# EasyEDA Pro project ProPrj_承载我所有幻想的键盘_2025-02-09.epro, schematic 01-Schematic, sheets 1 to 4 of 8

## Sheets
1 端口: Create Date: 2024-07-30; Page Name: 端口; Project Name: 承载我所有幻想的键盘; Schematic Name: 01-Schematic; Update Date: 2024-07-30
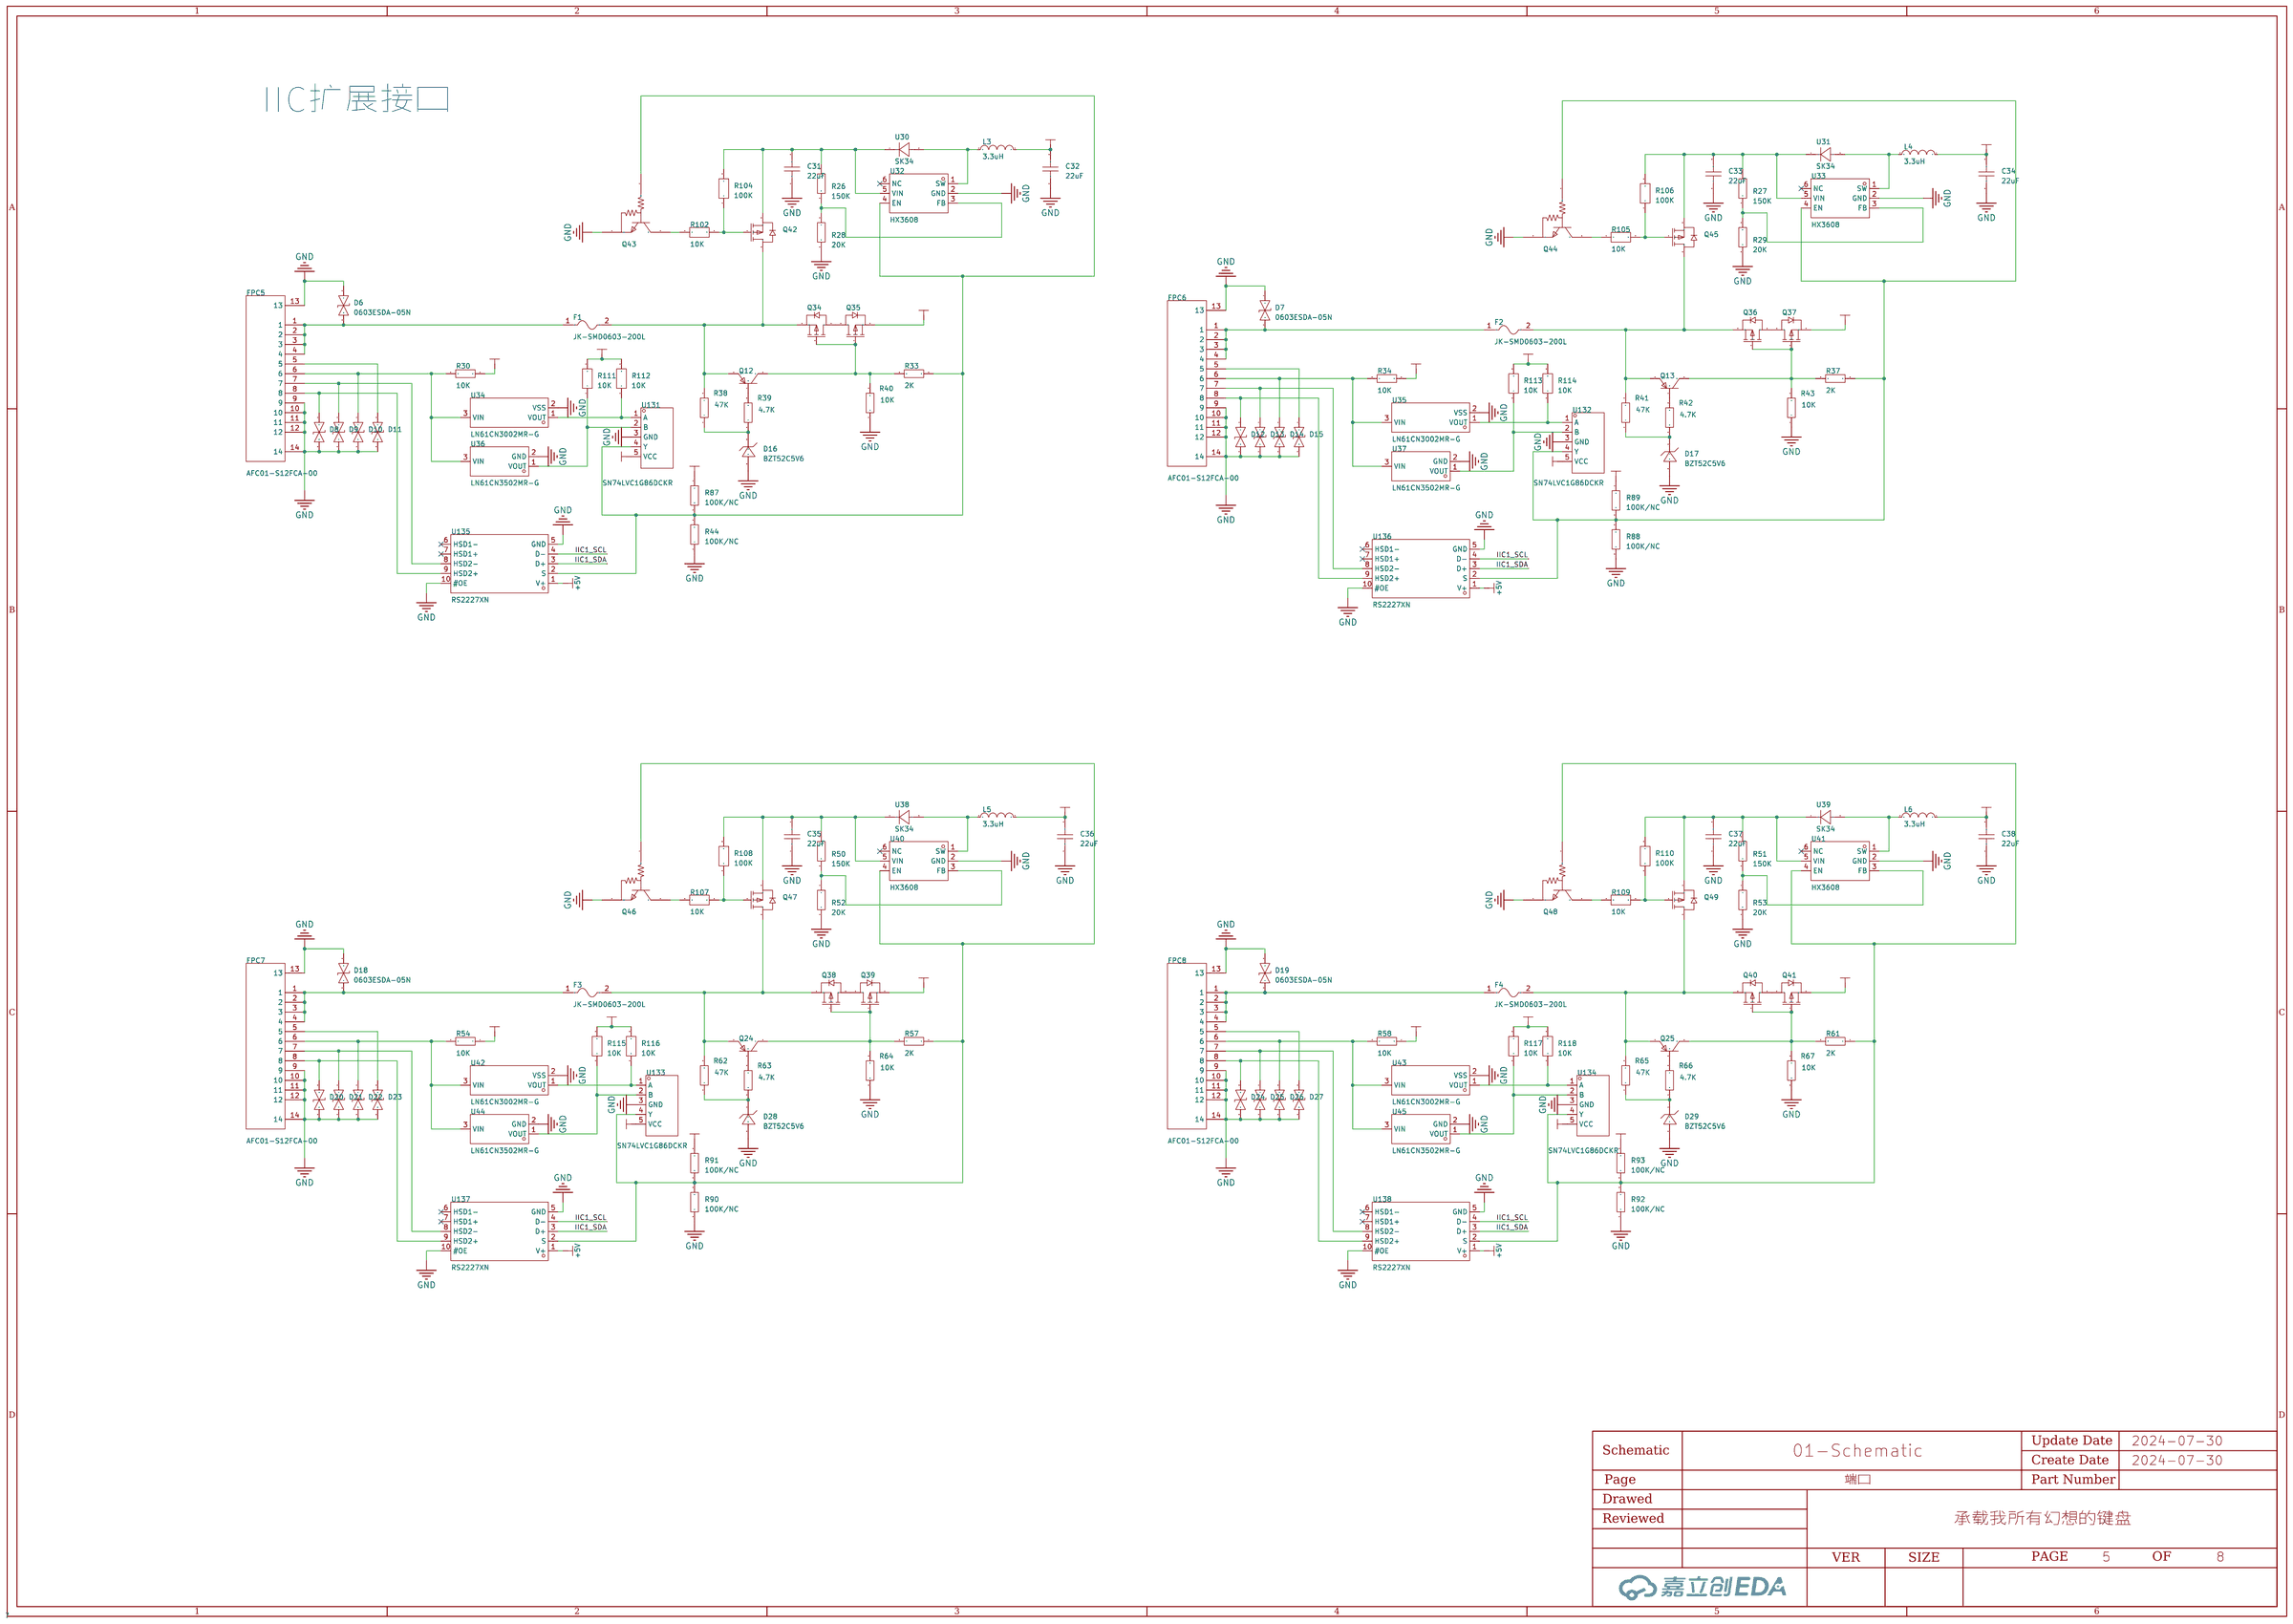
[diagram p0: 端口]
2 按键
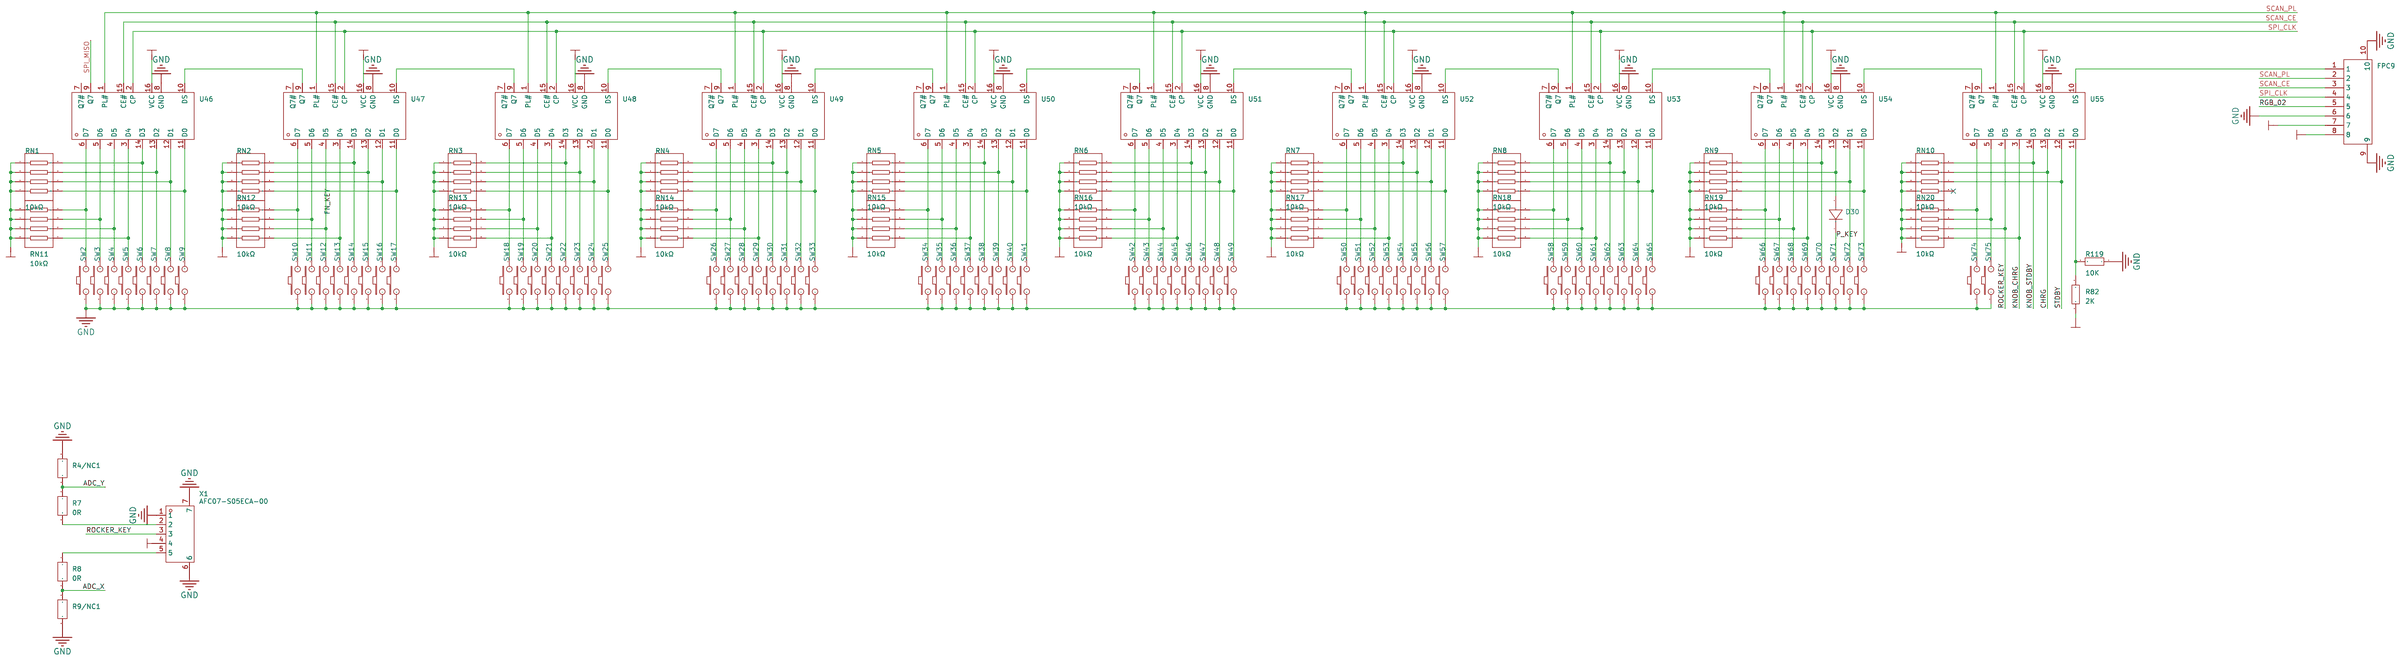
[diagram p1: 按键]
3 灯光
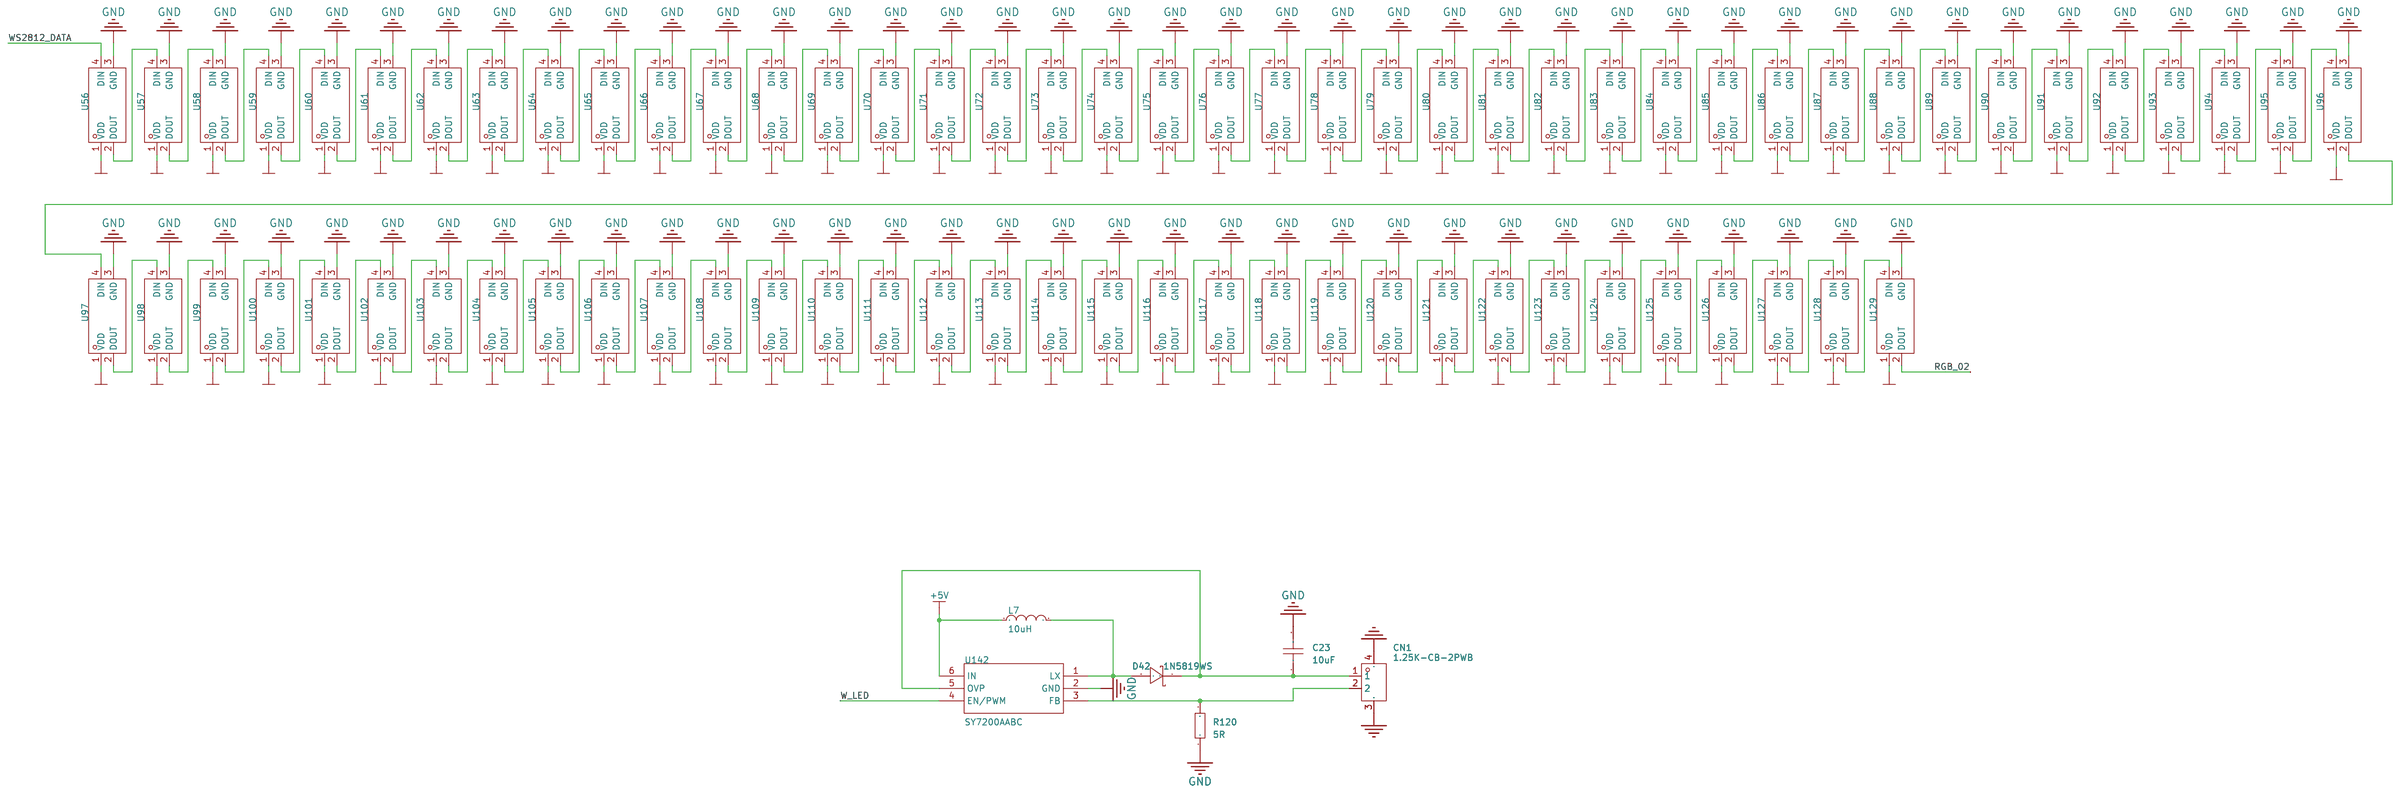
[diagram p2: 灯光]
4 主控: Page Name: 主控
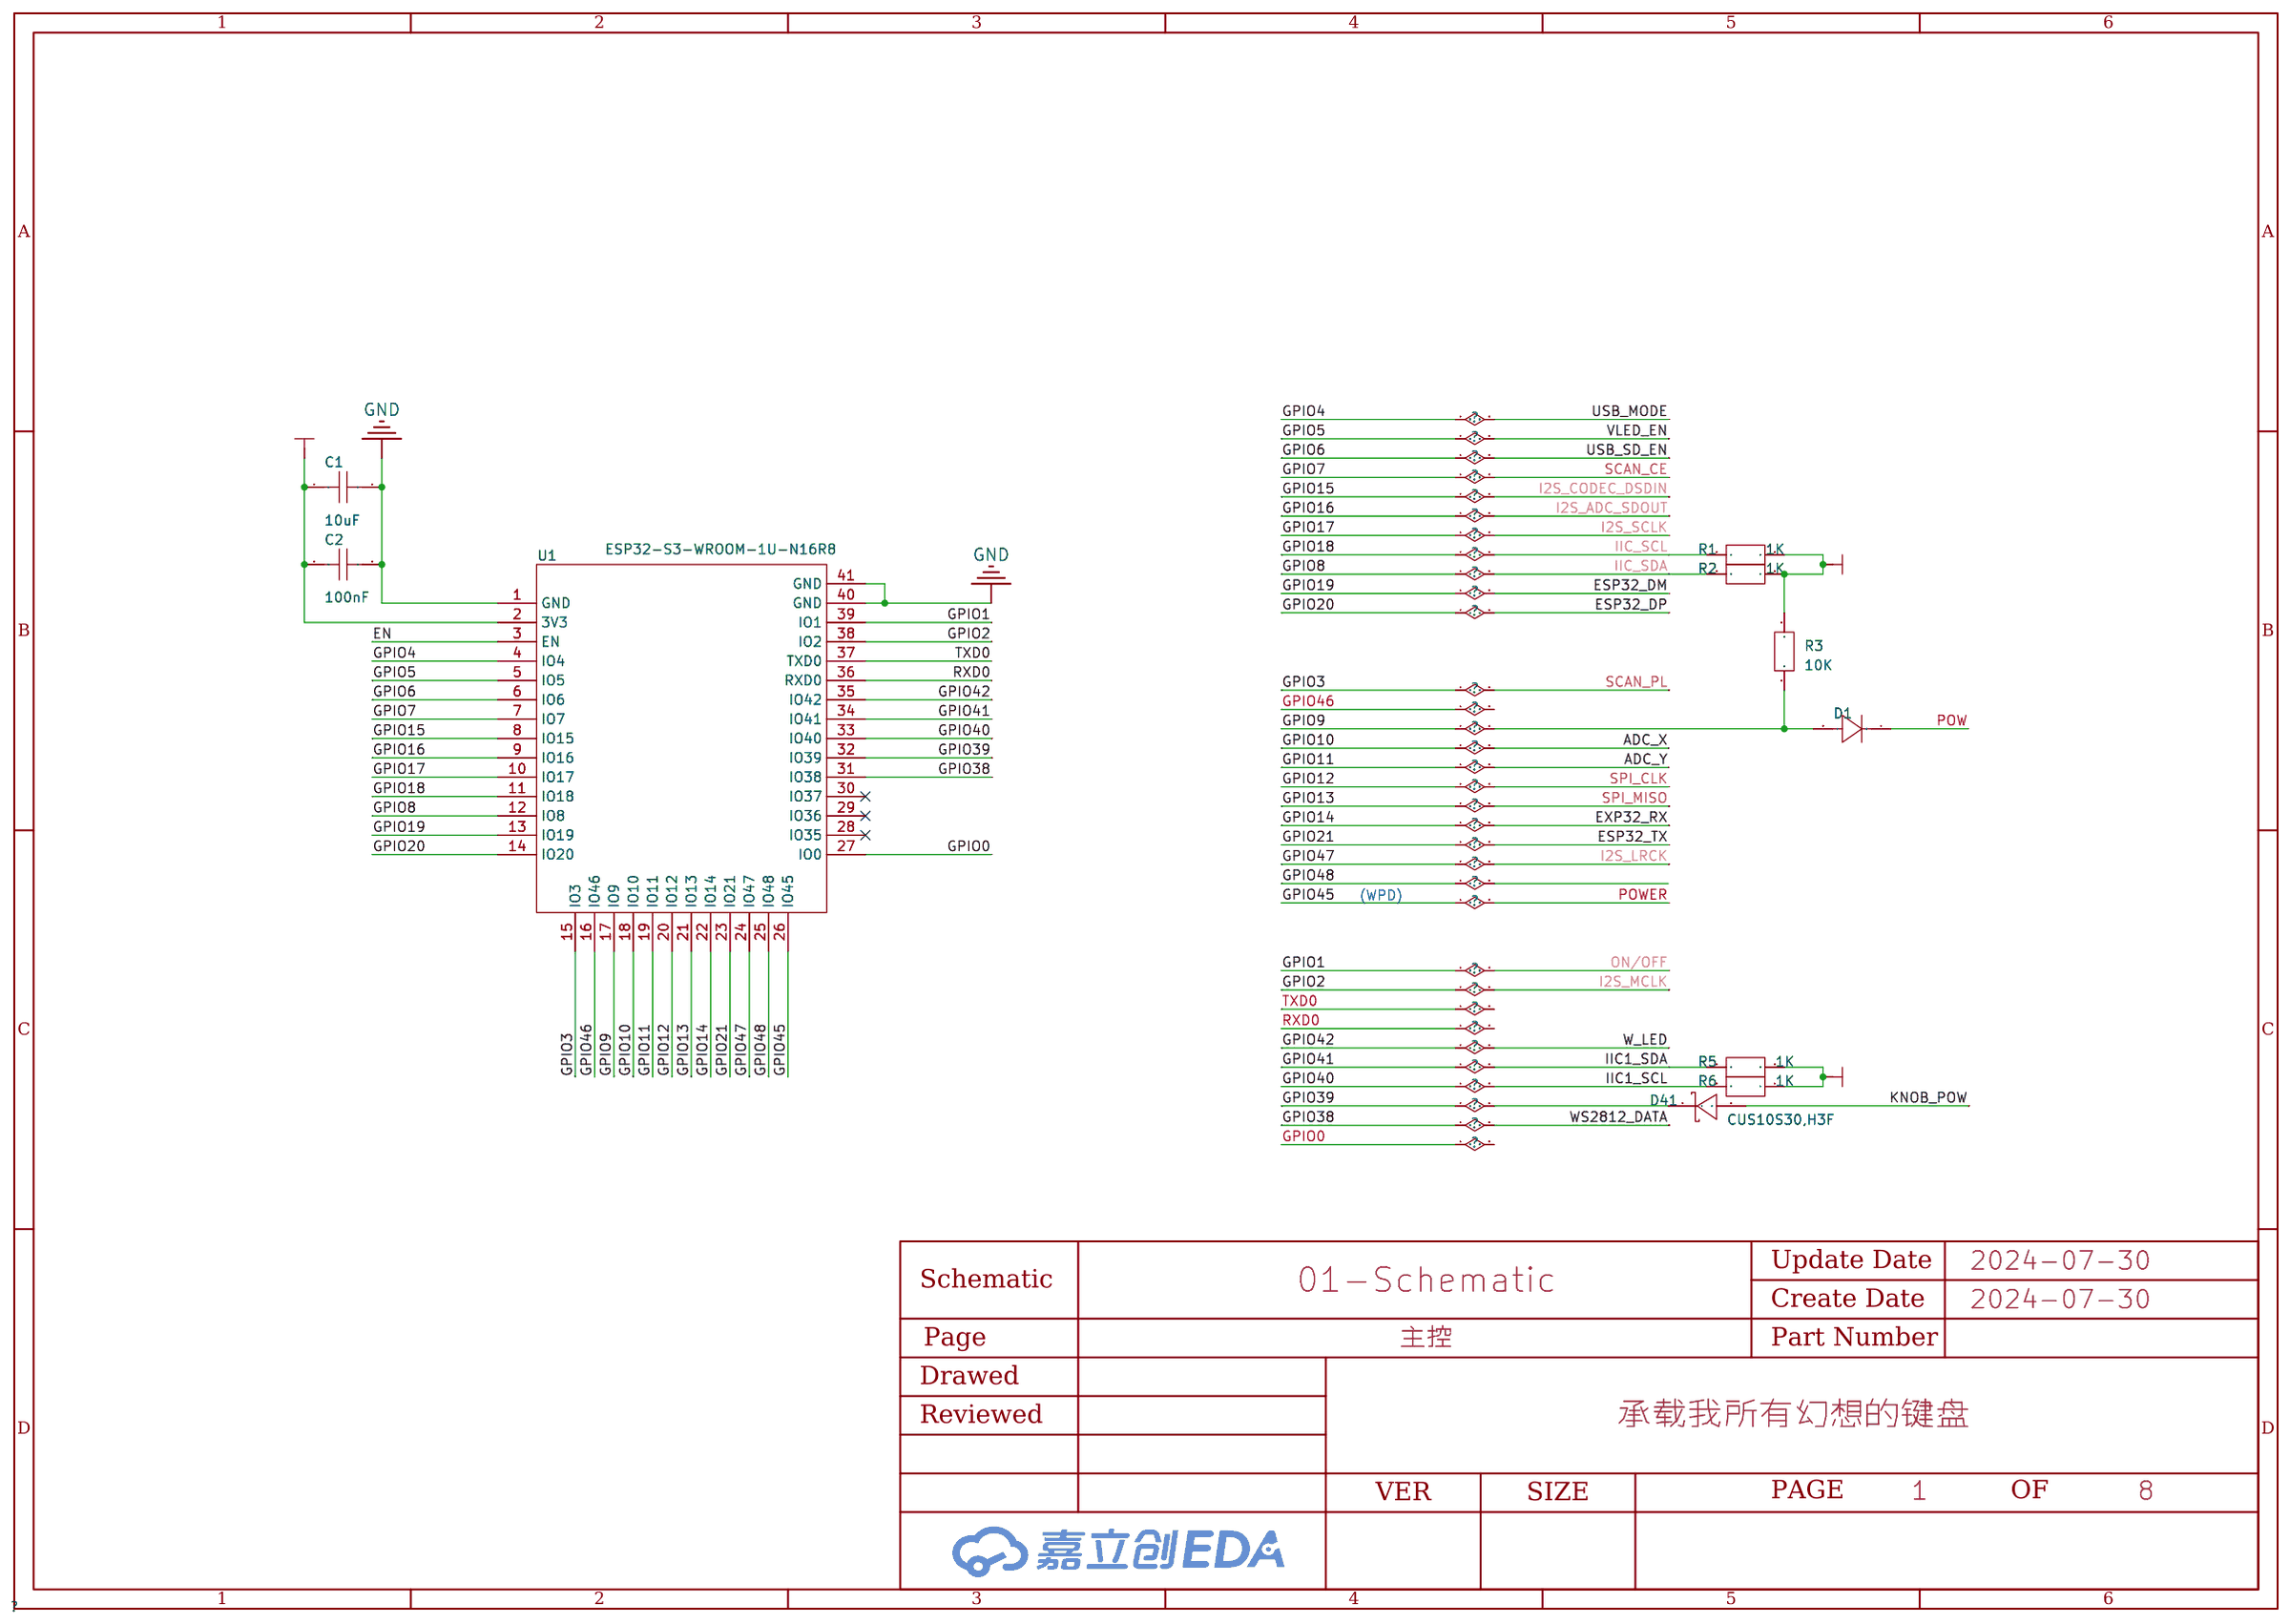
[diagram p3: 主控]

## Parts
sheet 主控
C1  10uF  [C0402]
C2  100nF  [C0402]
D1  1N4148WS  [SOD-323_L1.8-W1.3-LS2.5-RD]
D41  CUS10S30,H3F  [SOD-323_L1.8-W1.3-LS2.5-RD]
R1  1K  [R0402]
R2  1K  [R0402]
R3  10K  [R0402]
R5  1K  [R0402]
R6  1K  [R0402]
U1  ESP32-S3-WROOM-1U-N16R8  [WIRELM-SMD_ESP32-S3-WROOM-1U]
sheet 按键
D30  1N4148WS  [SOD-323_L1.8-W1.3-LS2.5-RD]
FPC9  -  [FPC-SMD_P0.50-8P_FGS-XJ-H2.0]
R4/NC1  SCR0402J10K  [R0402]
R7  0R  [R0402]
R8  0R  [R0402]
R9/NC1  SCR0402J10K  [R0402]
R82  2K  [R0603]
R119  10K  [R0603]
RN1  10kΩ  [RES-ARRAY-SMD_0603-8P-L3.2-W1.6-BL]
RN2  10kΩ  [RES-ARRAY-SMD_0603-8P-L3.2-W1.6-BL]
RN3  10kΩ  [RES-ARRAY-SMD_0603-8P-L3.2-W1.6-BL]
RN4  10kΩ  [RES-ARRAY-SMD_0603-8P-L3.2-W1.6-BL]
RN5  10kΩ  [RES-ARRAY-SMD_0603-8P-L3.2-W1.6-BL]
RN6  10kΩ  [RES-ARRAY-SMD_0603-8P-L3.2-W1.6-BL]
RN7  10kΩ  [RES-ARRAY-SMD_0603-8P-L3.2-W1.6-BL]
RN8  10kΩ  [RES-ARRAY-SMD_0603-8P-L3.2-W1.6-BL]
RN9  10kΩ  [RES-ARRAY-SMD_0603-8P-L3.2-W1.6-BL]
RN10  10kΩ  [RES-ARRAY-SMD_0603-8P-L3.2-W1.6-BL]
RN11  10kΩ  [RES-ARRAY-SMD_0603-8P-L3.2-W1.6-BL]
RN12  10kΩ  [RES-ARRAY-SMD_0603-8P-L3.2-W1.6-BL]
RN13  10kΩ  [RES-ARRAY-SMD_0603-8P-L3.2-W1.6-BL]
RN14  10kΩ  [RES-ARRAY-SMD_0603-8P-L3.2-W1.6-BL]
RN15  10kΩ  [RES-ARRAY-SMD_0603-8P-L3.2-W1.6-BL]
RN16  10kΩ  [RES-ARRAY-SMD_0603-8P-L3.2-W1.6-BL]
RN17  10kΩ  [RES-ARRAY-SMD_0603-8P-L3.2-W1.6-BL]
RN18  10kΩ  [RES-ARRAY-SMD_0603-8P-L3.2-W1.6-BL]
RN19  10kΩ  [RES-ARRAY-SMD_0603-8P-L3.2-W1.6-BL]
RN20  10kΩ  [RES-ARRAY-SMD_0603-8P-L3.2-W1.6-BL]
SW2  -  [轴座_焊接热插拔_不带灯]
SW3  -  [轴座_焊接热插拔_不带灯]
SW4  -  [轴座_焊接热插拔_不带灯]
SW5  -  [轴座_焊接热插拔_不带灯]
SW6  -  [轴座_焊接热插拔_不带灯]
SW7  -  [轴座_焊接热插拔_不带灯]
SW8  -  [轴座_焊接热插拔_不带灯]
SW9  -  [轴座_焊接热插拔_不带灯]
SW10  -  [轴座_焊接热插拔_不带灯]
SW11  -  [轴座_焊接热插拔_不带灯]
SW12  -  [轴座_焊接热插拔_不带灯]
SW13  -  [轴座_焊接热插拔_不带灯]
SW14  -  [轴座_焊接热插拔_不带灯]
SW15  -  [轴座_焊接热插拔_不带灯]
SW16  -  [轴座_焊接热插拔_不带灯]
SW17  -  [轴座_焊接热插拔_不带灯]
SW18  -  [轴座_焊接热插拔_不带灯]
SW19  -  [轴座_焊接热插拔_不带灯]
SW20  -  [轴座_焊接热插拔_不带灯]
SW21  -  [轴座_焊接热插拔_不带灯]
SW22  -  [轴座_焊接热插拔_不带灯]
SW23  -  [轴座_焊接热插拔_不带灯]
SW24  -  [轴座_焊接热插拔_不带灯]
SW25  -  [轴座_焊接热插拔_不带灯]
SW26  -  [轴座_焊接热插拔_不带灯]
SW27  -  [轴座_焊接热插拔_不带灯]
SW28  -  [轴座_焊接热插拔_不带灯]
SW29  -  [轴座_焊接热插拔_不带灯]
SW30  -  [轴座_焊接热插拔_不带灯]
SW31  -  [轴座_焊接热插拔_不带灯]
SW32  -  [轴座_焊接热插拔_不带灯]
SW33  -  [轴座_焊接热插拔_不带灯]
SW34  -  [轴座_焊接热插拔_不带灯]
SW35  -  [轴座_焊接热插拔_不带灯]
SW36  -  [轴座_焊接热插拔_不带灯]
SW37  -  [轴座_焊接热插拔_不带灯]
SW38  -  [轴座_焊接热插拔_不带灯]
SW39  -  [轴座_焊接热插拔_不带灯]
SW40  -  [轴座_焊接热插拔_不带灯]
SW41  -  [轴座_焊接热插拔_不带灯]
SW42  -  [轴座_焊接热插拔_不带灯]
SW43  -  [轴座_焊接热插拔_不带灯]
SW44  -  [轴座_焊接热插拔_不带灯]
SW45  -  [轴座_焊接热插拔_不带灯]
SW46  -  [轴座_焊接热插拔_不带灯]
SW47  -  [轴座_焊接热插拔_不带灯]
SW48  -  [轴座_焊接热插拔_不带灯]
SW49  -  [轴座_焊接热插拔_不带灯]
SW50  -  [轴座_焊接热插拔_不带灯]
SW51  -  [轴座_焊接热插拔_不带灯]
SW52  -  [轴座_焊接热插拔_不带灯]
SW53  -  [轴座_焊接热插拔_不带灯]
SW54  -  [轴座_焊接热插拔_不带灯]
SW55  -  [轴座_焊接热插拔_不带灯]
SW56  -  [轴座_焊接热插拔_不带灯]
SW57  -  [轴座_焊接热插拔_不带灯]
SW58  -  [轴座_焊接热插拔_不带灯]
SW59  -  [轴座_焊接热插拔_不带灯]
SW60  -  [轴座_焊接热插拔_不带灯]
SW61  -  [轴座_焊接热插拔_不带灯]
SW62  -  [轴座_焊接热插拔_不带灯]
SW63  -  [轴座_焊接热插拔_不带灯]
SW64  -  [轴座_焊接热插拔_不带灯]
SW65  -  [轴座_焊接热插拔_不带灯]
SW66  -  [轴座_焊接热插拔_不带灯]
SW67  -  [轴座_焊接热插拔_不带灯]
SW68  -  [轴座_焊接热插拔_不带灯]
SW69  -  [轴座_焊接热插拔_不带灯]
SW70  -  [轴座_焊接热插拔_不带灯]
SW71  -  [轴座_焊接热插拔_不带灯]
SW72  -  [轴座_焊接热插拔_不带灯]
SW73  -  [轴座_焊接热插拔_不带灯]
SW74  -  [轴座_焊接热插拔_不带灯]
SW75  -  [轴座_焊接热插拔_不带灯]
U46  -  [SOIC-16_L9.9-W3.9-P1.27-LS6.0-BL]
U47  -  [SOIC-16_L9.9-W3.9-P1.27-LS6.0-BL]
U48  -  [SOIC-16_L9.9-W3.9-P1.27-LS6.0-BL]
U49  -  [SOIC-16_L9.9-W3.9-P1.27-LS6.0-BL]
U50  -  [SOIC-16_L9.9-W3.9-P1.27-LS6.0-BL]
U51  -  [SOIC-16_L9.9-W3.9-P1.27-LS6.0-BL]
U52  -  [SOIC-16_L9.9-W3.9-P1.27-LS6.0-BL]
U53  -  [SOIC-16_L9.9-W3.9-P1.27-LS6.0-BL]
U54  -  [SOIC-16_L9.9-W3.9-P1.27-LS6.0-BL]
U55  -  [SOIC-16_L9.9-W3.9-P1.27-LS6.0-BL]
X1  AFC07-S05ECA-00  [FPC-SMD_AFC07-S05ECA-00]
sheet 灯光
C23  10uF  [C0402]
CN1  1.25K-CB-2PWB  [CONN-SMD_2P-P1.25_L5.5-W7.7-2PWB]
D42  1N5819WS  [SOD-323_L1.8-W1.3-LS2.5-RD]
L7  10uH  [IND-SMD_L2.5-W2.0]
R120  5R  [R0402]
U56  Yo-WS2812B-3528反贴雾状  [LED-SMD_L3.2-W2.8-BR_DY-S352818]
U57  Yo-WS2812B-3528反贴雾状  [LED-SMD_L3.2-W2.8-BR_DY-S352818]
U58  Yo-WS2812B-3528反贴雾状  [LED-SMD_L3.2-W2.8-BR_DY-S352818]
U59  Yo-WS2812B-3528反贴雾状  [LED-SMD_L3.2-W2.8-BR_DY-S352818]
U60  Yo-WS2812B-3528反贴雾状  [LED-SMD_L3.2-W2.8-BR_DY-S352818]
U61  Yo-WS2812B-3528反贴雾状  [LED-SMD_L3.2-W2.8-BR_DY-S352818]
U62  Yo-WS2812B-3528反贴雾状  [LED-SMD_L3.2-W2.8-BR_DY-S352818]
U63  Yo-WS2812B-3528反贴雾状  [LED-SMD_L3.2-W2.8-BR_DY-S352818]
U64  Yo-WS2812B-3528反贴雾状  [LED-SMD_L3.2-W2.8-BR_DY-S352818]
U65  Yo-WS2812B-3528反贴雾状  [LED-SMD_L3.2-W2.8-BR_DY-S352818]
U66  Yo-WS2812B-3528反贴雾状  [LED-SMD_L3.2-W2.8-BR_DY-S352818]
U67  Yo-WS2812B-3528反贴雾状  [LED-SMD_L3.2-W2.8-BR_DY-S352818]
U68  Yo-WS2812B-3528反贴雾状  [LED-SMD_L3.2-W2.8-BR_DY-S352818]
U69  Yo-WS2812B-3528反贴雾状  [LED-SMD_L3.2-W2.8-BR_DY-S352818]
U70  Yo-WS2812B-3528反贴雾状  [LED-SMD_L3.2-W2.8-BR_DY-S352818]
U71  Yo-WS2812B-3528反贴雾状  [LED-SMD_L3.2-W2.8-BR_DY-S352818]
U72  Yo-WS2812B-3528反贴雾状  [LED-SMD_L3.2-W2.8-BR_DY-S352818]
U73  Yo-WS2812B-3528反贴雾状  [LED-SMD_L3.2-W2.8-BR_DY-S352818]
U74  Yo-WS2812B-3528反贴雾状  [LED-SMD_L3.2-W2.8-BR_DY-S352818]
U75  Yo-WS2812B-3528反贴雾状  [LED-SMD_L3.2-W2.8-BR_DY-S352818]
U76  Yo-WS2812B-3528反贴雾状  [LED-SMD_L3.2-W2.8-BR_DY-S352818]
U77  Yo-WS2812B-3528反贴雾状  [LED-SMD_L3.2-W2.8-BR_DY-S352818]
U78  Yo-WS2812B-3528反贴雾状  [LED-SMD_L3.2-W2.8-BR_DY-S352818]
U79  Yo-WS2812B-3528反贴雾状  [LED-SMD_L3.2-W2.8-BR_DY-S352818]
U80  Yo-WS2812B-3528反贴雾状  [LED-SMD_L3.2-W2.8-BR_DY-S352818]
U81  Yo-WS2812B-3528反贴雾状  [LED-SMD_L3.2-W2.8-BR_DY-S352818]
U82  Yo-WS2812B-3528反贴雾状  [LED-SMD_L3.2-W2.8-BR_DY-S352818]
U83  Yo-WS2812B-3528反贴雾状  [LED-SMD_L3.2-W2.8-BR_DY-S352818]
U84  Yo-WS2812B-3528反贴雾状  [LED-SMD_L3.2-W2.8-BR_DY-S352818]
U85  Yo-WS2812B-3528反贴雾状  [LED-SMD_L3.2-W2.8-BR_DY-S352818]
U86  Yo-WS2812B-3528反贴雾状  [LED-SMD_L3.2-W2.8-BR_DY-S352818]
U87  Yo-WS2812B-3528反贴雾状  [LED-SMD_L3.2-W2.8-BR_DY-S352818]
U88  Yo-WS2812B-3528反贴雾状  [LED-SMD_L3.2-W2.8-BR_DY-S352818]
U89  Yo-WS2812B-3528反贴雾状  [LED-SMD_L3.2-W2.8-BR_DY-S352818]
U90  Yo-WS2812B-3528反贴雾状  [LED-SMD_L3.2-W2.8-BR_DY-S352818]
U91  Yo-WS2812B-3528反贴雾状  [LED-SMD_L3.2-W2.8-BR_DY-S352818]
U92  Yo-WS2812B-3528反贴雾状  [LED-SMD_L3.2-W2.8-BR_DY-S352818]
U93  Yo-WS2812B-3528反贴雾状  [LED-SMD_L3.2-W2.8-BR_DY-S352818]
U94  Yo-WS2812B-3528反贴雾状  [LED-SMD_L3.2-W2.8-BR_DY-S352818]
U95  Yo-WS2812B-3528反贴雾状  [LED-SMD_L3.2-W2.8-BR_DY-S352818]
U96  Yo-WS2812B-3528反贴雾状  [LED-SMD_L3.2-W2.8-BR_DY-S352818]
U97  Yo-WS2812B-3528反贴雾状  [LED-SMD_L3.2-W2.8-BR_DY-S352818]
U98  Yo-WS2812B-3528反贴雾状  [LED-SMD_L3.2-W2.8-BR_DY-S352818]
U99  Yo-WS2812B-3528反贴雾状  [LED-SMD_L3.2-W2.8-BR_DY-S352818]
U100  Yo-WS2812B-3528反贴雾状  [LED-SMD_L3.2-W2.8-BR_DY-S352818]
U101  Yo-WS2812B-3528反贴雾状  [LED-SMD_L3.2-W2.8-BR_DY-S352818]
U102  Yo-WS2812B-3528反贴雾状  [LED-SMD_L3.2-W2.8-BR_DY-S352818]
U103  Yo-WS2812B-3528反贴雾状  [LED-SMD_L3.2-W2.8-BR_DY-S352818]
U104  Yo-WS2812B-3528反贴雾状  [LED-SMD_L3.2-W2.8-BR_DY-S352818]
U105  Yo-WS2812B-3528反贴雾状  [LED-SMD_L3.2-W2.8-BR_DY-S352818]
U106  Yo-WS2812B-3528反贴雾状  [LED-SMD_L3.2-W2.8-BR_DY-S352818]
U107  Yo-WS2812B-3528反贴雾状  [LED-SMD_L3.2-W2.8-BR_DY-S352818]
U108  Yo-WS2812B-3528反贴雾状  [LED-SMD_L3.2-W2.8-BR_DY-S352818]
U109  Yo-WS2812B-3528反贴雾状  [LED-SMD_L3.2-W2.8-BR_DY-S352818]
U110  Yo-WS2812B-3528反贴雾状  [LED-SMD_L3.2-W2.8-BR_DY-S352818]
U111  Yo-WS2812B-3528反贴雾状  [LED-SMD_L3.2-W2.8-BR_DY-S352818]
U112  Yo-WS2812B-3528反贴雾状  [LED-SMD_L3.2-W2.8-BR_DY-S352818]
U113  Yo-WS2812B-3528反贴雾状  [LED-SMD_L3.2-W2.8-BR_DY-S352818]
U114  Yo-WS2812B-3528反贴雾状  [LED-SMD_L3.2-W2.8-BR_DY-S352818]
U115  Yo-WS2812B-3528反贴雾状  [LED-SMD_L3.2-W2.8-BR_DY-S352818]
U116  Yo-WS2812B-3528反贴雾状  [LED-SMD_L3.2-W2.8-BR_DY-S352818]
U117  Yo-WS2812B-3528反贴雾状  [LED-SMD_L3.2-W2.8-BR_DY-S352818]
U118  Yo-WS2812B-3528反贴雾状  [LED-SMD_L3.2-W2.8-BR_DY-S352818]
U119  Yo-WS2812B-3528反贴雾状  [LED-SMD_L3.2-W2.8-BR_DY-S352818]
U120  Yo-WS2812B-3528反贴雾状  [LED-SMD_L3.2-W2.8-BR_DY-S352818]
U121  Yo-WS2812B-3528反贴雾状  [LED-SMD_L3.2-W2.8-BR_DY-S352818]
U122  Yo-WS2812B-3528反贴雾状  [LED-SMD_L3.2-W2.8-BR_DY-S352818]
U123  Yo-WS2812B-3528反贴雾状  [LED-SMD_L3.2-W2.8-BR_DY-S352818]
U124  Yo-WS2812B-3528反贴雾状  [LED-SMD_L3.2-W2.8-BR_DY-S352818]
U125  Yo-WS2812B-3528反贴雾状  [LED-SMD_L3.2-W2.8-BR_DY-S352818]
U126  Yo-WS2812B-3528反贴雾状  [LED-SMD_L3.2-W2.8-BR_DY-S352818]
U127  Yo-WS2812B-3528反贴雾状  [LED-SMD_L3.2-W2.8-BR_DY-S352818]
U128  Yo-WS2812B-3528反贴雾状  [LED-SMD_L3.2-W2.8-BR_DY-S352818]
U129  Yo-WS2812B-3528反贴雾状  [LED-SMD_L3.2-W2.8-BR_DY-S352818]
U142  SY7200AABC  [SOT-23-6_L2.9-W1.6-P0.95-LS2.8-BR]
sheet 端口
C31  22uF  [C0603]
C32  22uF  [C0603]
C33  22uF  [C0603]
C34  22uF  [C0603]
C35  22uF  [C0603]
C36  22uF  [C0603]
C37  22uF  [C0603]
C38  22uF  [C0603]
D6  0603ESDA-05N  [D0603-BI]
D7  0603ESDA-05N  [D0603-BI]
D8  0603ESDA-05N  [D0603-BI]
D9  0603ESDA-05N  [D0603-BI]
D10  0603ESDA-05N  [D0603-BI]
D11  0603ESDA-05N  [D0603-BI]
D12  0603ESDA-05N  [D0603-BI]
D13  0603ESDA-05N  [D0603-BI]
D14  0603ESDA-05N  [D0603-BI]
D15  0603ESDA-05N  [D0603-BI]
D16  BZT52C5V6  [SOD-123_L2.8-W1.8-LS3.7-RD]
D17  BZT52C5V6  [SOD-123_L2.8-W1.8-LS3.7-RD]
D18  0603ESDA-05N  [D0603-BI]
D19  0603ESDA-05N  [D0603-BI]
D20  0603ESDA-05N  [D0603-BI]
D21  0603ESDA-05N  [D0603-BI]
D22  0603ESDA-05N  [D0603-BI]
D23  0603ESDA-05N  [D0603-BI]
D24  0603ESDA-05N  [D0603-BI]
D25  0603ESDA-05N  [D0603-BI]
D26  0603ESDA-05N  [D0603-BI]
D27  0603ESDA-05N  [D0603-BI]
D28  BZT52C5V6  [SOD-123_L2.8-W1.8-LS3.7-RD]
D29  BZT52C5V6  [SOD-123_L2.8-W1.8-LS3.7-RD]
F1  JK-SMD0603-200L  [F0603]
F2  JK-SMD0603-200L  [F0603]
F3  JK-SMD0603-200L  [F0603]
F4  JK-SMD0603-200L  [F0603]
FPC5  AFC01-S12FCA-00  [FPC-SMD_AFC01-S12FCA-00]
FPC6  AFC01-S12FCA-00  [FPC-SMD_AFC01-S12FCA-00]
FPC7  AFC01-S12FCA-00  [FPC-SMD_AFC01-S12FCA-00]
FPC8  AFC01-S12FCA-00  [FPC-SMD_AFC01-S12FCA-00]
L3  3.3uH  [IND-SMD_L4.4-W4.2-A]
L4  3.3uH  [IND-SMD_L4.4-W4.2-A]
L5  3.3uH  [IND-SMD_L4.4-W4.2-A]
L6  3.3uH  [IND-SMD_L4.4-W4.2-A]
Q12  -  [TO-236-3_L2.9-W1.3-P1.90-LS2.4-BR]
Q13  -  [TO-236-3_L2.9-W1.3-P1.90-LS2.4-BR]
Q24  -  [TO-236-3_L2.9-W1.3-P1.90-LS2.4-BR]
Q25  -  [TO-236-3_L2.9-W1.3-P1.90-LS2.4-BR]
Q34  3401  [SOT-23-3_L2.9-W1.3-P1.90-LS2.4-BR]
Q35  3401  [SOT-23-3_L2.9-W1.3-P1.90-LS2.4-BR]
Q36  3401  [SOT-23-3_L2.9-W1.3-P1.90-LS2.4-BR]
Q37  3401  [SOT-23-3_L2.9-W1.3-P1.90-LS2.4-BR]
Q38  3401  [SOT-23-3_L2.9-W1.3-P1.90-LS2.4-BR]
Q39  3401  [SOT-23-3_L2.9-W1.3-P1.90-LS2.4-BR]
Q40  3401  [SOT-23-3_L2.9-W1.3-P1.90-LS2.4-BR]
Q41  3401  [SOT-23-3_L2.9-W1.3-P1.90-LS2.4-BR]
Q42  3401  [SOT-23-3_L2.9-W1.3-P1.90-LS2.4-BR]
Q43  LMUN2212LT1G  [SOT-23-3_L2.9-W1.3-P1.90-LS2.4-BR]
Q44  LMUN2212LT1G  [SOT-23-3_L2.9-W1.3-P1.90-LS2.4-BR]
Q45  3401  [SOT-23-3_L2.9-W1.3-P1.90-LS2.4-BR]
Q46  LMUN2212LT1G  [SOT-23-3_L2.9-W1.3-P1.90-LS2.4-BR]
Q47  3401  [SOT-23-3_L2.9-W1.3-P1.90-LS2.4-BR]
Q48  LMUN2212LT1G  [SOT-23-3_L2.9-W1.3-P1.90-LS2.4-BR]
Q49  3401  [SOT-23-3_L2.9-W1.3-P1.90-LS2.4-BR]
R26  150K  [R0603]
R27  150K  [R0603]
R28  20K  [R0603]
R29  20K  [R0603]
R30  10K  [R0603]
R33  2K  [R0603]
R34  10K  [R0603]
R37  2K  [R0603]
R38  47K  [R0603]
R39  4.7K  [R0603]
R40  10K  [R0603]
R41  47K  [R0603]
R42  4.7K  [R0603]
R43  10K  [R0603]
R44  100K/NC  [R0603]
R50  150K  [R0603]
R51  150K  [R0603]
R52  20K  [R0603]
R53  20K  [R0603]
R54  10K  [R0603]
R57  2K  [R0603]
R58  10K  [R0603]
R61  2K  [R0603]
R62  47K  [R0603]
R63  4.7K  [R0603]
R64  10K  [R0603]
R65  47K  [R0603]
R66  4.7K  [R0603]
R67  10K  [R0603]
R87  100K/NC  [R0603]
R88  100K/NC  [R0603]
R89  100K/NC  [R0603]
R90  100K/NC  [R0603]
R91  100K/NC  [R0603]
R92  100K/NC  [R0603]
R93  100K/NC  [R0603]
R102  10K  [R0603]
R104  100K  [R0603]
R105  10K  [R0603]
R106  100K  [R0603]
R107  10K  [R0603]
R108  100K  [R0603]
R109  10K  [R0603]
R110  100K  [R0603]
R111  10K  [R0603]
R112  10K  [R0603]
R113  10K  [R0603]
R114  10K  [R0603]
R115  10K  [R0603]
R116  10K  [R0603]
R117  10K  [R0603]
R118  10K  [R0603]
U30  SK34  [SMA_L4.3-W2.6-LS5.1-RD]
U31  SK34  [SMA_L4.3-W2.6-LS5.1-RD]
U32  HX3608  [SOT-23-6_L2.9-W1.6-P0.95-LS2.8-BR]
U33  HX3608  [SOT-23-6_L2.9-W1.6-P0.95-LS2.8-BR]
U34  LN61CN3002MR-G  [SOT-23-3_L2.9-W1.6-P1.90-LS2.8-BR]
U35  LN61CN3002MR-G  [SOT-23-3_L2.9-W1.6-P1.90-LS2.8-BR]
U36  LN61CN3502MR-G  [SOT-23_L2.9-W1.3-P1.90-LS2.4-BR]
U37  LN61CN3502MR-G  [SOT-23_L2.9-W1.3-P1.90-LS2.4-BR]
U38  SK34  [SMA_L4.3-W2.6-LS5.1-RD]
U39  SK34  [SMA_L4.3-W2.6-LS5.1-RD]
U40  HX3608  [SOT-23-6_L2.9-W1.6-P0.95-LS2.8-BR]
U41  HX3608  [SOT-23-6_L2.9-W1.6-P0.95-LS2.8-BR]
U42  LN61CN3002MR-G  [SOT-23-3_L2.9-W1.6-P1.90-LS2.8-BR]
U43  LN61CN3002MR-G  [SOT-23-3_L2.9-W1.6-P1.90-LS2.8-BR]
U44  LN61CN3502MR-G  [SOT-23_L2.9-W1.3-P1.90-LS2.4-BR]
U45  LN61CN3502MR-G  [SOT-23_L2.9-W1.3-P1.90-LS2.4-BR]
U131  SN74LVC1G86DCKR  [SC-70-5_L2.1-W1.3-P0.65-LS2.1-BR]
U132  SN74LVC1G86DCKR  [SC-70-5_L2.1-W1.3-P0.65-LS2.1-BR]
U133  SN74LVC1G86DCKR  [SC-70-5_L2.1-W1.3-P0.65-LS2.1-BR]
U134  SN74LVC1G86DCKR  [SC-70-5_L2.1-W1.3-P0.65-LS2.1-BR]
U135  RS2227XN  [MSOP-10_L3.0-W3.0-P0.50-LS5.0-BL]
U136  RS2227XN  [MSOP-10_L3.0-W3.0-P0.50-LS5.0-BL]
U137  RS2227XN  [MSOP-10_L3.0-W3.0-P0.50-LS5.0-BL]
U138  RS2227XN  [MSOP-10_L3.0-W3.0-P0.50-LS5.0-BL]

## Library data of the parts
C1 = ZRB15XR61A106ME01D: 容值:10uF;精度:±20%;额定电压:-;材质(温度系数):-;; LCSC Part Name: 10uF ±20%; Supplier Part: C527590; Manufacturer: muRata(村田); Supplier Footprint: 0402; JLCPCB Part Class: 扩展库; Datasheet: https://atta.szlcsc.com/upload/public/pdf/source/20200507/C527590_05B2D18D24F6232E70970638CDBF66E1.pdf; Supplier: LCSC; Tolerance: ±20%
C2 = GCM155R71C104KA55J: 容值:100nF;精度:±10%;额定电压:-;材质(温度系数):-;; LCSC Part Name: 100nF ±10%; Supplier Part: C2655418; Manufacturer: muRata(村田); Supplier Footprint: 0402; JLCPCB Part Class: 扩展库; Datasheet: https://atta.szlcsc.com/upload/public/pdf/source/20210701/42090801FDE37D0E45AFF657247F4A08.pdf; Supplier: LCSC; Tolerance: ±10%
D1 D30 = 1N4148WS_C727111: 二极管配置:独立式;功率:400mW;直流反向耐压(Vr):100V;平均整流电流(Io):300mA;正向压降(Vf):1.25V@150mA;反向电流(Ir):1A@75V;反向恢复时间(trr):8ns;工作温度:-55~+150@(Tj);; LCSC Part Name: 100V 300mA 8ns; Supplier Part: C727111; Manufacturer: TWGMC(台湾迪嘉); Supplier Footprint: SOD-323; JLCPCB Part Class: Extended Part; Datasheet: https://atta.szlcsc.com/upload/public/pdf/source/20200828/C727111_E7108F014A9288D320E3440593CCDF54.pdf; Supplier: LCSC; Diode Configuration: 独立式; Power Dissipation: 400mW; Reverse Voltage (Vr): 100V; Average Rectified Current (Io): 300mA; Forward Voltage (Vf@If): 1.25V@150mA; Reverse Leakage Current: 1A@75V; Reverse Recovery Time (trr): 8ns; Operating Temperature: -55~+150@(Tj)
D41 = CUS10S30,H3F: 正向压降(Vf):230mV@100mA;直流反向耐压(Vr):30V;平均整流电流(Io):1A;; LCSC Part Name: 电压:30V 电流:1A; Supplier Part: C146335; Manufacturer: TOSHIBA(东芝); Supplier Footprint: SC-76(SOD-323); Datasheet: https://atta.szlcsc.com/upload/public/pdf/source/20171211/C146335_15129763734771175369.pdf; Supplier: LCSC; Forward Voltage (Vf@If): 230mV@100mA; Reverse Voltage (Vr): 30V; Average Rectified Current (Io): 1A; Reverse Leakage Current (Ir): 500uA@30V
R1-R3 R4/NC1 R5-R8 R9/NC1 = SCR0402J10K: Supplier Part: C3017497; Manufacturer: VO(翔胜); Supplier Footprint: 0402; JLCPCB Part Class: 扩展库; Datasheet: https://atta.szlcsc.com/upload/public/pdf/source/20220513/247AF9639BA21CF93567DC289CCC6A22.pdf; Supplier: LCSC
U1 = ESP32-S3-WROOM-1U-N16R8: Supplier Part: C3013946; Manufacturer: ESPRESSIF(乐鑫); Supplier Footprint: SMD; JLCPCB Part Class: 扩展库; Datasheet: https://atta.szlcsc.comnull; Supplier: LCSC
FPC9 = AFC01-S08FCA-00: 间距:0.5mm;触点数量:8;锁定特性:翻盖式;安装类型:卧贴;触点类型:下接;; LCSC Part Name: 0.5mm P数:8 翻盖式 下接; Supplier Part: C262657; Manufacturer: JS(钜硕电子); Supplier Footprint: SMD,P=0.5mm; Datasheet: https://atta.szlcsc.com/upload/public/pdf/source/20180814/C262657_E4DDBFDEF95394073062C4B6399AAD54.pdf; Supplier: LCSC; Pitch: 0.5mm; Number of Contacts: 8; Locking Feature: 翻盖式; Mounting Type: 卧贴; Contact Type: 下接; Height Above Board: 2mm; FFC, FCB Thickness: 0.3mm
R26-R30 R33 R34 R37-R44 R50-R54 R57 R58 R61-R67 R82 R87-R93 R119 = Res_0603: Supplier Footprint: 0603
RN1-RN10 RN12-RN20 = 4D03WGJ0103T5E: 阻值:10kΩ;精度:±5%;单个元件功率:62.5mW;温度系数:±200ppm/;电阻器数:4;引脚数:8;; LCSC Part Name: 10kΩ ±5%; Supplier Part: C29718; Manufacturer: UNI-ROYAL(厚声); Supplier Footprint: 0603x4; Datasheet: https://atta.szlcsc.com/upload/public/pdf/source/20170615/1497511005633.pdf; Supplier: LCSC; Tolerance: ±5%; Power(Watts): 62.5mW; Temperature Coefficient: ±200ppm/; Number of Resistors: 4; Number of Pins: 8
RN11 = 4D03WGJ0103T5E: 阻值:10kΩ;精度:±5%;单个元件功率:62.5mW;温度系数:±200ppm/℃;电阻器数:4;引脚数:8;; LCSC Part Name: 10kΩ ±5%; Supplier Part: C29718; Manufacturer: UNI-ROYAL(厚声); Supplier Footprint: 0603x4; Datasheet: https://atta.szlcsc.com/upload/public/pdf/source/20170615/1497511005633.pdf; Supplier: LCSC; Tolerance: ±5%; Power(Watts): 62.5mW; Temperature Coefficient: ±200ppm/℃; Number of Resistors: 4; Number of Pins: 8
SW2-SW75 = KEYBOARD-SW: Origin Footprint 2: MX-KEY
U46-U55 = 74HC165D,653: Supplier Part: C5613; Manufacturer: Nexperia(安世); Supplier Footprint: SOIC-16_150mil; Datasheet: https://atta.szlcsc.com/upload/public/pdf/source/20160218/1457707760975.pdf; Supplier: LCSC
X1 = AFC07-S05ECA-00: 锁定特性:抽屉式;触点类型:上接;触点数量:5P;间距:0.5mm;安装类型:卧贴;工作温度范围:-;; LCSC Part Name: 间距:0.5mm P数:5P 抽屉式 上接; Supplier Part: C262578; Manufacturer: JS(钜硕电子); Supplier Footprint: SMD,P=0.5mm,卧贴; Datasheet: https://atta.szlcsc.com/upload/public/pdf/source/20190816/C413943_B2A877D529C9540F79BD785FB8B72D0A.pdf; Supplier: LCSC; Locking Feature: 抽屉式; Contact Type: 上接; Number of Contacts: 5P; Pitch: 0.5mm; Mounting Type: 卧贴; FFC, FCB Thickness: 0.3mm; Height Above Board: 2mm
C23 = CL05A106MP5NUNC: 容值:10uF;精度:±20%;额定电压:10V;材质(温度系数):X5R;; LCSC Part Name: 10uF ±20% 10V; Supplier Part: C315248; Manufacturer: SAMSUNG(三星); Supplier Footprint: 0402; JLCPCB Part Class: Extended Part; Datasheet: https://atta.szlcsc.com/upload/public/pdf/source/20200102/C478861_C4302703595930F3C0E62DAD3349F1AA.pdf; Supplier: LCSC; Tolerance: ±20%; Voltage Rated: 10V; Temperature Coefficient: X5R
CN1 = 1.25K-CB-2PWB: 插针结构:1x2P;间距:1.25mm;安装方式:卧贴;参考系列:-;总PIN数:2P;排数:1;每排PIN数:2;行距:-;额定电流:1A;工作温度范围:-25℃~+85℃;; LCSC Part Name: 1x2P 间距:1.25mm 卧贴; Supplier Part: C2919570; Manufacturer: HDGC(华德共创); Supplier Footprint: SMD,P=1.25mm,卧贴; Datasheet: https://atta.szlcsc.com/upload/public/pdf/source/20211115/F776F48743F73668B48ED2809AC4027A.pdf; Supplier: LCSC; Pins Structure: 1x2P; Pitch: 1.25mm; Mounting Style: 卧贴; Number of Pins: 2P; Number of Rows: 1; Number of PINs Per Row: 2; Current Rating (Max): 1A; Operating Temperature Range: -25℃~+85℃
D42 = 1N5819WS_C191023: 正向压降(Vf):600mV@1A;直流反向耐压(Vr):40V;平均整流电流(Io):1A;; LCSC Part Name: 电压:40V 电流:1A; Supplier Part: C191023; Manufacturer: Hottech(合科泰); Supplier Footprint: SOD-323; JLCPCB Part Class: 基础库; Datasheet: https://atta.szlcsc.com/upload/public/pdf/source/20220428/3CB86FD8D28D653594B4E35F9D5AEFD9.pdf; Supplier: LCSC; Forward Voltage (Vf@If): 600mV@1A; Reverse Voltage (Vr): 40V; Average Rectified Current (Io): 1A
L7 = FTC252012S100MBCA: 电感值:10uH;精度:±20%;额定电流:1.2A;饱和电流(Isat):1.6A;类型:一体成型电感;; LCSC Part Name: 10uH ±20% 1.6A; Supplier Part: C5832376; Manufacturer: cjiang(长江微电); Supplier Footprint: SMD,2x2.5mm; JLCPCB Part Class: 扩展库; Datasheet: https://atta.szlcsc.com/upload/public/pdf/source/20230602/8FFEDA9C0247A92A0D4B67554BFE4091.pdf; Supplier: LCSC; Tolerance: ±20%; Rated Current: 1.2A; Saturation Current (Isat): 1.6A; DC Resistance (DCR): 330mΩ; Type: 一体成型电感
R120 = Res_0402: Supplier Footprint: 0402
U56-U129 = YO-WS2812B-3528反贴: Supplier: LCSC; Supplier Part: C9900003682; Manufacturer: null
U142 = SY7200AABC: 30V 2A LED驱动 升压 效率高达96% 软启动 LED开路保护; Supplier Part: C107309; Manufacturer: silergy(矽力杰); Supplier Footprint: SOT-23-6; JLCPCB Part Class: 扩展库; Datasheet: https://atta.szlcsc.com/upload/public/pdf/source/20170925/C107309_1506321334417990079.pdf; Supplier: LCSC
C31-C38 = CAP_0603: Supplier Footprint: 0603
D6-D15 D18-D27 = 0603ESDA-05N: 极性:双向;反向截止电压(Vrwm):5V;最大钳位电压:50V;; LCSC Part Name: 双向ESD; Supplier Part: C316054; Manufacturer: BORN(伯恩半导体); Supplier Footprint: 0603; JLCPCB Part Class: 扩展库; Datasheet: https://atta.szlcsc.com/upload/public/pdf/source/20200528/C316054_1CC523E9CE69E41C8DD5A05C832CCD1A.pdf; Supplier: LCSC; polarity: 双向; Reverse Stand-Off Voltage (Vrwm): 5V; Maximum Clamping Voltage: 50V; Type: ESD
D16 D17 D28 D29 = BZT52C5V6_C173406: 二极管配置:独立式;稳压值(标称值):5.6V;稳压值(范围):5.2V~6V;功率:500mW;精度:-;; Supplier Part: C173406; Manufacturer: MDD; Supplier Footprint: SOD-123; JLCPCB Part Class: 扩展库; Datasheet: https://atta.szlcsc.com/upload/public/pdf/source/20230823/A46C7C97908205398E4407DE202CED03.pdf; Supplier: LCSC; Diode Configuration: 独立式; Zener Voltage (Nom): 5.6V; Reverse Leakage Current (Ir): 1uA@2V; Zener Voltage (Range): 5.2V~6V; Power Dissipation: 500mW; Zener Impedance (Zzt): 40Ω
F1-F4 = JK-SMD0603-200L: 最大电压:6V;最大电流:50A;保持电流:2A;跳闸电流:4A;; LCSC Part Name: 6V 2A 0603自恢复; Supplier Part: C720073; Manufacturer: JK(金科); Supplier Footprint: 0603; JLCPCB Part Class: 扩展库; Datasheet: https://atta.szlcsc.com/upload/public/pdf/source/20200810/C720073_7A10DBEF65205E7BB5E59A04A78F2F0C.pdf; Supplier: LCSC; Operating Voltage (Max): 6V; Current Rating (Max): 50A; Hold Current: 2A; Trip Current: 4A; Power Dissipation: 500mW; Resistance - Initial (Ri) (Min): 12mΩ; Resistance - Post Trip (R1) (Max): 60mΩ; Maximum Time to Trip: 5s; Operating Temperature: -40℃~+85℃
FPC5-FPC8 = AFC01-S12FCA-00: 锁定特性:翻盖式;触点类型:下接;触点数量:12P;间距:0.5mm;安装类型:卧贴;; LCSC Part Name: 间距:0.5mm P数:12P 翻盖式 下接; Supplier Part: C262661; Manufacturer: JS(钜硕电子); Supplier Footprint: SMD,P=0.5mm,卧贴; JLCPCB Part Class: 扩展库; Datasheet: https://atta.szlcsc.com/upload/public/pdf/source/20190816/C413942_2A72D1AC756EAE17EEDF756A339D4500.pdf; Supplier: LCSC; Locking Feature: 翻盖式; Contact Type: 下接; Number of Contacts: 12P; Pitch: 0.5mm; Mounting Type: 卧贴; FFC, FCB Thickness: 0.3mm; Height Above Board: 2mm
L3-L6 = FXL0420-3R3-M: 电感值:3.3uH;精度:±20%;额定电流:3.3A;饱和电流(Isat):4A;类型:一体成型电感;; LCSC Part Name: 3.3uH ±20% 4A; Supplier Part: C167207; Manufacturer: cjiang(长江微电); Supplier Footprint: SMD,4.2x4.4mm; JLCPCB Part Class: 扩展库; Datasheet: https://atta.szlcsc.com/upload/public/pdf/source/20230516/FBADA9890E7FBE97C620F1D8B562D733.pdf; Supplier: LCSC; Tolerance: ±20%; Rated Current: 3.3A; Saturation Current (Isat): 4A; DC Resistance (DCR): 87mΩ; Type: 一体成型电感
Q12 Q13 Q24 Q25 = S8550_PNP: 晶体管类型:PNP;集射极击穿电压(Vceo):25V;集电极电流(Ic):500mA;功率(Pd):300mW;集电极-发射极饱和电压(VCE(sat)@Ic,Ib):600mV@500mA,50mA;直流电流增益(hFE@Ic,Vce):-;特征频率(fT):150MHz;工作温度:+150@(Tj);; Supplier Footprint: SOT-23
Q34-Q42 Q45 Q47 Q49 = 3401_C239055: 类型:P沟道;漏源电压(Vdss):30V;连续漏极电流(Id):4.2A;功率(Pd):1.2W;导通电阻(RDS(on)@Vgs,Id):55mΩ@10V,4.2A;阈值电压(Vgs(th)@Id):1.3V@250A;; LCSC Part Name: P沟道 30V 4.2A; Supplier Part: C239055; Manufacturer: GOFORD(谷峰); Supplier Footprint: SOT-23(SOT-23-3); JLCPCB Part Class: Extended Part; Datasheet: https://atta.szlcsc.com/upload/public/pdf/source/20180619/C239055_DDCD8D435643D304BC40BD7DEC0BB420.pdf; Supplier: LCSC; Type: P沟道; Drain Source Voltage (Vdss): 30V; Continuous Drain Current (Id): 4.2A; Power Dissipation (Pd): 1.2W; Drain Source On Resistance (RDS(on)@Vgs,Id): 55mΩ@10V,4.2A; Gate Threshold Voltage (Vgs(th)@Id): 1.3V@250A
Q43 Q44 Q46 Q48 = LMUN2212LT1G: 晶体管类型:1个NPN-预偏置;功率(Pd):246mW;集电极电流(Ic):100mA;集射极击穿电压(Vceo):50V;; LCSC Part Name: 1个NPN-预偏置 100mA 50V; Supplier Part: C43984; Manufacturer: LRC(乐山无线电); Supplier Footprint: SOT-23(SOT-23-3); JLCPCB Part Class: Extended Part; Datasheet: https://atta.szlcsc.com/upload/public/pdf/source/20171014/C43984_15079757509251038527.pdf; Supplier: LCSC; Transistor Type: 1个NPN-预偏置; Power Dissipation (Pd): 246mW; Collector Current (Ic): 100mA; Collector-Emitter Breakdown Voltage (Vceo): 50V
R102 R104-R118 = FRQ0603J104 TS: LCSC Part Name: 0603 ±5% 100K; Supplier Part: C2934392; Manufacturer: FOJAN(富捷); Supplier Footprint: 0603; Datasheet: https://atta.szlcsc.com/upload/public/pdf/source/20220510/440184775277A181327570BE5F6AE936.pdf; Supplier: LCSC
U30 U31 U38 U39 = SK34_C5140034: 正向压降(Vf):550mV@3A;直流反向耐压(Vr):40V;平均整流电流(Io):3A;; LCSC Part Name: 电压:40V 电流:3A; Supplier Part: C5140034; Manufacturer: MSKSEMI(美森科); Supplier Footprint: SMA; JLCPCB Part Class: 扩展库; Datasheet: https://atta.szlcsc.com/upload/public/pdf/source/20231010/D5BADFAA775C26BADCA22E21E9DB9002.pdf; Supplier: LCSC; Forward Voltage (Vf@If): 550mV@3A; Reverse Voltage (Vr): 40V; Average Rectified Current (Io): 3A
U32 U33 U40 U41 = HX3608: 功能类型:升压型;输入电压:2V~24V;输出电压:2.5V~28V;输出电流(最大值):3.5A;; Supplier Part: C296278; Manufacturer: HX(恒佳兴); Supplier Footprint: SOT-23-6L; JLCPCB Part Class: 扩展库; Datasheet: https://atta.szlcsc.com/upload/public/pdf/source/20181119/C296278_77FFD4221F60AEB235A13FC0B82FB718.pdf; Supplier: LCSC; Function: 升压型; Input Voltage: 2V~24V; Output Voltage: 2.5V~28V; Output Current (Max): 3.5A; Switching Frequency: 1.2MHz; Synchronous Rectification: 否; Number of Outputs: 1; Topology: 升压式; Switch tube (built-in/external): 内置
U34 U35 U42 U43 = LN61CN3002MR-G: Supplier Part: C236393; Manufacturer: natlinear(南麟); Supplier Footprint: SOT-23; JLCPCB Part Class: 扩展库; Datasheet: https://atta.szlcsc.com/upload/public/pdf/source/20180720/C236393_C06A23DF63EBD6ED68953D7A1AD1E2A7.pdf; Supplier: LCSC
U36 U37 U44 U45 = LN61CN3502MR-G: Supplier Part: C141416; Manufacturer: natlinear(南麟); Supplier Footprint: SOT-23; JLCPCB Part Class: 扩展库; Datasheet: https://atta.szlcsc.com/upload/public/pdf/source/20171110/C141418_15102792347801104211.pdf; Supplier: LCSC
U131-U134 = SN74LVC1G86DCKR: 逻辑类型:异或门;通道数:1;电源电压:1.65V~5.5V;静态电流(最大值):10uA;最大传播延迟:4ns@5V,50pF;; Supplier Part: C52350; Manufacturer: TI(德州仪器); Supplier Footprint: SC-70-5; JLCPCB Part Class: 扩展库; Datasheet: https://www.ti.com/cn/lit/gpn/sn74lvc1g86; Supplier: LCSC; Logic Gate Type: 异或门; Number of Channels: 1; Supply Voltage: 1.65V~5.5V; Quiescent Current (Max): 10uA; Sink Current: 32mA; Source Current: 32mA; High Level Range (VIH): 1.7V~2V; Low Level Range (VIL): 700mV~800mV; Series: 74LVC系列; Propagation Delay Time: 4ns@5V,50pF; Operating Temperature: -40℃~+125℃
U135-U138 = RS2227XN: 开关电路:-;多路复用器/解复用器电路:-;导通电阻（最大值）:-;开关电压（最大值）:-;; LCSC Part Name: 模拟开关RS2227XN; Supplier Part: C255478; Manufacturer: RUNIC(润石); Supplier Footprint: MSOP-10; JLCPCB Part Class: 扩展库; Datasheet: https://atta.szlcsc.com/upload/public/pdf/watermark/20190926/C255478_D49089ECE2A541195D1EEBCAD82CD8F3.pdf; Supplier: LCSC

## Nets
3V3: C1.1 C2.1 R1.2 R2.1 R3.1 R5.2 R6.1 U1.2(3V3) X1.4 ; also on sheet 6 7
+5V: L7.2 R30.1 R34.1 R54.1 R58.1 R87.1 R89.1 R91.1 R93.1 R111.2 R112.2 R113.2 R114.2 R115.2 R116.2 R117.2 R118.2 U131.5(VCC) U132.5(VCC) U133.5(VCC) U134.5(VCC) U135.1(V+) U136.1(V+) U137.1(V+) U138.1(V+) U142.6(IN) ; also on sheet 5 6 7
GND: C1.2 C2.2 C23.2 C31.1 C32.1 C33.1 C34.1 C35.1 C36.1 C37.1 C38.1 CN1.3 CN1.4 D6.1 D7.1 D8.2 D9.2 D10.2 D11.2 D12.2 D13.2 D14.2 D15.2 D16.2 D17.2 D18.1 D19.1 D20.2 D21.2 D22.2 D23.2 D24.2 D25.2 D26.2 D27.2 D28.2 D29.2 FPC5.9 FPC5.10 FPC5.11 FPC5.12 FPC5.13 FPC5.14 FPC6.9 FPC6.10 FPC6.11 FPC6.12 FPC6.13 FPC6.14 FPC7.9 FPC7.10 FPC7.11 FPC7.12 FPC7.13 FPC7.14 FPC8.9 FPC8.10 FPC8.11 FPC8.12 FPC8.13 FPC8.14 FPC9.6 FPC9.9 FPC9.10 Q43.2(E) Q44.2(E) Q46.2(E) Q48.2(E) R4/NC1.1 R9/NC1.2 R28.2 R29.2 R40.1 R43.1 R44.1 R52.2 R53.2 R64.1 R67.1 R88.1 R90.1 R92.1 R119.1 R120.1 SW2.1 SW3.1 SW4.1 SW5.1 SW6.1 SW7.1 SW8.1 SW9.1 SW10.1 SW11.1 SW12.1 SW13.1 SW14.1 SW15.1 SW16.1 SW17.1 SW18.1 SW19.1 SW20.1 SW21.1 SW22.1 SW23.1 SW24.1 SW25.1 SW26.1 SW27.1 SW28.1 SW29.1 SW30.1 SW31.1 SW32.1 SW33.1 SW34.1 SW35.1 SW36.1 SW37.1 SW38.1 SW39.1 SW40.1 SW41.1 SW42.1 SW43.1 SW44.1 SW45.1 SW46.1 SW47.1 SW48.1 SW49.1 SW50.1 SW51.1 SW52.1 SW53.1 SW54.1 SW55.1 SW56.1 SW57.1 SW58.1 SW59.1 SW60.1 SW61.1 SW62.1 SW63.1 SW64.1 SW65.1 SW66.1 SW67.1 SW68.1 SW69.1 SW70.1 SW71.1 SW72.1 SW73.1 SW74.1 SW75.1 U1.1(GND) U1.40(GND) U1.41(GND) U32.2(GND) U33.2(GND) U34.2(VSS) U35.2(VSS) U36.2(GND) U37.2(GND) U40.2(GND) U41.2(GND) U42.2(VSS) U43.2(VSS) U44.2(GND) U45.2(GND) U46.8(GND) U47.8(GND) U48.8(GND) U49.8(GND) U50.8(GND) U51.8(GND) U52.8(GND) U53.8(GND) U54.8(GND) U55.8(GND) U56.3(GND) U57.3(GND) U58.3(GND) U59.3(GND) U60.3(GND) U61.3(GND) U62.3(GND) U63.3(GND) U64.3(GND) U65.3(GND) U66.3(GND) U67.3(GND) U68.3(GND) U69.3(GND) U70.3(GND) U71.3(GND) U72.3(GND) U73.3(GND) U74.3(GND) U75.3(GND) U76.3(GND) U77.3(GND) U78.3(GND) U79.3(GND) U80.3(GND) U81.3(GND) U82.3(GND) U83.3(GND) U84.3(GND) U85.3(GND) U86.3(GND) U87.3(GND) U88.3(GND) U89.3(GND) U90.3(GND) U91.3(GND) U92.3(GND) U93.3(GND) U94.3(GND) U95.3(GND) U96.3(GND) U97.3(GND) U98.3(GND) U99.3(GND) U100.3(GND) U101.3(GND) U102.3(GND) U103.3(GND) U104.3(GND) U105.3(GND) U106.3(GND) U107.3(GND) U108.3(GND) U109.3(GND) U110.3(GND) U111.3(GND) U112.3(GND) U113.3(GND) U114.3(GND) U115.3(GND) U116.3(GND) U117.3(GND) U118.3(GND) U119.3(GND) U120.3(GND) U121.3(GND) U122.3(GND) U123.3(GND) U124.3(GND) U125.3(GND) U126.3(GND) U127.3(GND) U128.3(GND) U129.3(GND) U131.3(GND) U132.3(GND) U133.3(GND) U134.3(GND) U135.5(GND) U135.10(#OE) U136.5(GND) U136.10(#OE) U137.5(GND) U137.10(#OE) U138.5(GND) U138.10(#OE) U142.2(GND) X1.1 X1.6 X1.7 ; also on sheet 5 6 7 8
VBAT: C32.2 C34.2 C36.2 C38.2 FPC9.8 L3.1 L4.1 L5.1 L6.1 RN1.1 RN1.2 RN1.3 RN1.4 RN2.5 RN2.6 RN2.7 RN2.8 RN3.1 RN3.2 RN3.3 RN3.4 RN4.1 RN4.2 RN4.3 RN4.4 RN5.1 RN5.2 RN5.3 RN5.4 RN6.1 RN6.2 RN6.3 RN6.4 RN7.1 RN7.2 RN7.3 RN7.4 RN8.1 RN8.2 RN8.3 RN8.4 RN9.1 RN9.2 RN9.3 RN9.4 RN10.1 RN10.2 RN10.3 RN10.4 RN11.5 RN11.6 RN11.7 RN11.8 RN12.5 RN12.6 RN12.7 RN12.8 RN13.1 RN13.2 RN13.3 RN13.4 RN14.1 RN14.2 RN14.3 RN14.4 RN15.1 RN15.2 RN15.3 RN15.4 RN16.1 RN16.2 RN16.3 RN16.4 RN17.1 RN17.2 RN17.3 RN17.4 RN18.1 RN18.2 RN18.3 RN18.4 RN19.1 RN19.2 RN19.3 RN19.4 RN20.1 RN20.2 RN20.3 RN20.4 U46.16(VCC) U47.16(VCC) U48.16(VCC) U49.16(VCC) U50.16(VCC) U51.16(VCC) U52.16(VCC) U53.16(VCC) U54.16(VCC) U55.16(VCC) ; also on sheet 6 8
ADC_X: R8.2 R9/NC1.1 U1.18(IO10)
ADC_Y: R4/NC1.2 R7.1 U1.19(IO11)
CHRG: RN10.6 U55.13(D2) ; also on sheet 6
EN: U1.3(EN) ; also on sheet 7
ESP32_DM: U1.13(IO19) ; also on sheet 5
ESP32_DP: U1.14(IO20) ; also on sheet 5
ESP32_TX: U1.23(IO21) ; also on sheet 7
EXP32_RX: U1.22(IO14) ; also on sheet 7
FN_KEY: RN12.3 SW12.2 U47.4(D5)
GPIO0: U1.27(IO0) ; also on sheet 7
GPIO1: U1.39(IO1) ; also on sheet 8
GPIO2: U1.38(IO2) ; also on sheet 8
GPIO3: FPC9.2 U1.15(IO3) U46.1(PL#) U47.1(PL#) U48.1(PL#) U49.1(PL#) U50.1(PL#) U51.1(PL#) U52.1(PL#) U53.1(PL#) U54.1(PL#) U55.1(PL#)
GPIO4: U1.4(IO4) ; also on sheet 5
GPIO5: U1.5(IO5) ; also on sheet 6
GPIO6: U1.6(IO6) ; also on sheet 5
GPIO7: FPC9.3 U1.7(IO7) U46.15(CE#) U47.15(CE#) U48.15(CE#) U49.15(CE#) U50.15(CE#) U51.15(CE#) U52.15(CE#) U53.15(CE#) U54.15(CE#) U55.15(CE#)
GPIO8: R2.2 U1.12(IO8) ; also on sheet 8
GPIO9: D1.2(A) R3.2 U1.17(IO9)
GPIO12: FPC9.4 U1.20(IO12) U46.2(CP) U47.2(CP) U48.2(CP) U49.2(CP) U50.2(CP) U51.2(CP) U52.2(CP) U53.2(CP) U54.2(CP) U55.2(CP)
GPIO13: U1.21(IO13) U46.9(Q7)
GPIO15: U1.8(IO15) ; also on sheet 8
GPIO16: U1.9(IO16) ; also on sheet 8
GPIO17: U1.10(IO17) ; also on sheet 8
GPIO18: R1.1 U1.11(IO18) ; also on sheet 8
GPIO38: U1.31(IO38) U56.4(DIN)
GPIO39: D41.1(K) U1.32(IO39)
GPIO40: R6.2 U1.33(IO40) U135.4(D-) U136.4(D-) U137.4(D-) U138.4(D-) ; also on sheet 6
GPIO41: R5.1 U1.34(IO41) U135.3(D+) U136.3(D+) U137.3(D+) U138.3(D+) ; also on sheet 6
GPIO42: U1.35(IO42) U142.4(EN/PWM)
GPIO45: U1.26(IO45) ; also on sheet 6
GPIO46: U1.16(IO46) ; also on sheet 7
GPIO47: U1.24(IO47) ; also on sheet 8
GPIO48: U1.25(IO48)
KNOB_CHRG: RN20.8 U55.3(D4) ; also on sheet 6
KNOB_POW: D41.2(A) ; also on sheet 7
KNOB_STDBY: RN10.5 U55.14(D3) ; also on sheet 6
P_KEY: D30.1(C) SW71.2 ; also on sheet 6
POW: D1.1(C)
RGB_02: FPC9.5 U129.2(DOUT)
ROCKER_KEY: RN20.7 U55.4(D5) X1.3
RXD0: U1.36(RXD0) ; also on sheet 7
STDBY: RN10.7 U55.12(D1) ; also on sheet 6
TXD0: U1.37(TXD0) ; also on sheet 7
VCHARGE: Q35.2(S) Q37.2(S) Q39.2(S) Q41.2(S) ; also on sheet 6
VLED: FPC9.7 U56.1(VDD) U57.1(VDD) U58.1(VDD) U59.1(VDD) U60.1(VDD) U61.1(VDD) U62.1(VDD) U63.1(VDD) U64.1(VDD) U65.1(VDD) U66.1(VDD) U67.1(VDD) U68.1(VDD) U69.1(VDD) U70.1(VDD) U71.1(VDD) U72.1(VDD) U73.1(VDD) U74.1(VDD) U75.1(VDD) U76.1(VDD) U77.1(VDD) U78.1(VDD) U79.1(VDD) U80.1(VDD) U81.1(VDD) U82.1(VDD) U83.1(VDD) U84.1(VDD) U85.1(VDD) U86.1(VDD) U87.1(VDD) U88.1(VDD) U89.1(VDD) U90.1(VDD) U91.1(VDD) U92.1(VDD) U93.1(VDD) U94.1(VDD) U95.1(VDD) U96.1(VDD) U97.1(VDD) U98.1(VDD) U99.1(VDD) U100.1(VDD) U101.1(VDD) U102.1(VDD) U103.1(VDD) U104.1(VDD) U105.1(VDD) U106.1(VDD) U107.1(VDD) U108.1(VDD) U109.1(VDD) U110.1(VDD) U111.1(VDD) U112.1(VDD) U113.1(VDD) U114.1(VDD) U115.1(VDD) U116.1(VDD) U117.1(VDD) U118.1(VDD) U119.1(VDD) U120.1(VDD) U121.1(VDD) U122.1(VDD) U123.1(VDD) U124.1(VDD) U125.1(VDD) U126.1(VDD) U127.1(VDD) U128.1(VDD) U129.1(VDD) ; also on sheet 6
VUSB: R82.1 ; also on sheet 5 6 7
$1N25476: D16.1 R38.1 R39.1
$1N25479: Q12.1(B) R39.2
$1N25481: Q12.3(C) Q34.1(G) Q35.1(G) R33.2 R40.2
$1N25505: L3.2 U30.2(A) U32.1(SW)
$1N25516: R26.2 R28.1 U32.3(FB)
$1N25541: D6.2 F1.1 FPC5.1 FPC5.2 FPC5.3 FPC5.4
$1N25555: R112.1 U34.1(VOUT) U131.1(A)
$1N25559: R111.1 U36.1(VOUT) U131.2(B)
$1N25580: Q43.1(B) R33.1 R44.2 R87.2 U32.4(EN) U131.4(Y) U135.2(S)
$1N25601: D10.1 FPC5.6 R30.2 U34.3(VIN) U36.3(VIN)
$1N25610: D11.1 FPC5.5
$1N25617: D17.1 R41.1 R42.1
$1N25620: Q13.1(B) R42.2
$1N25622: Q13.3(C) Q36.1(G) Q37.1(G) R37.2 R43.2
$1N25646: L4.2 U31.2(A) U33.1(SW)
$1N25657: R27.2 R29.1 U33.3(FB)
$1N25682: D7.2 F2.1 FPC6.1 FPC6.2 FPC6.3 FPC6.4
$1N25696: R114.1 U35.1(VOUT) U132.1(A)
$1N25700: R113.1 U37.1(VOUT) U132.2(B)
$1N25721: Q44.1(B) R37.1 R88.2 R89.2 U33.4(EN) U132.4(Y) U136.2(S)
$1N25742: D14.1 FPC6.6 R34.2 U35.3(VIN) U37.3(VIN)
$1N25751: D15.1 FPC6.5
$1N25758: D28.1 R62.1 R63.1
$1N25761: Q24.1(B) R63.2
$1N25763: Q24.3(C) Q38.1(G) Q39.1(G) R57.2 R64.2
$1N25787: L5.2 U38.2(A) U40.1(SW)
$1N25798: R50.2 R52.1 U40.3(FB)
$1N25823: D18.2 F3.1 FPC7.1 FPC7.2 FPC7.3 FPC7.4
$1N25837: R116.1 U42.1(VOUT) U133.1(A)
$1N25841: R115.1 U44.1(VOUT) U133.2(B)
$1N25862: Q46.1(B) R57.1 R90.2 R91.2 U40.4(EN) U133.4(Y) U137.2(S)
$1N25883: D22.1 FPC7.6 R54.2 U42.3(VIN) U44.3(VIN)
$1N25892: D23.1 FPC7.5
$1N25899: D29.1 R65.1 R66.1
$1N25902: Q25.1(B) R66.2
$1N25904: Q25.3(C) Q40.1(G) Q41.1(G) R61.2 R67.2
$1N25928: L6.2 U39.2(A) U41.1(SW)
$1N25939: R51.2 R53.1 U41.3(FB)
$1N25964: D19.2 F4.1 FPC8.1 FPC8.2 FPC8.3 FPC8.4
$1N25978: R118.1 U43.1(VOUT) U134.1(A)
$1N25982: R117.1 U45.1(VOUT) U134.2(B)
$1N26024: D26.1 FPC8.6 R58.2 U43.3(VIN) U45.3(VIN)
$1N26033: D27.1 FPC8.5
$1N33733: D9.1 FPC5.7 U135.8(HSD2-)
$1N34076: D8.1 FPC5.8 U135.9(HSD2+)
$1N35171: D21.1 FPC7.7 U137.8(HSD2-)
$1N35184: D20.1 FPC7.8 U137.9(HSD2+)
$1N35197: D25.1 FPC8.7 U138.8(HSD2-)
$1N35210: D24.1 FPC8.8 U138.9(HSD2+)
$1N35236: D12.1 FPC6.8 U136.9(HSD2+)
$1N48937: Q48.1(B) R61.1 R92.2 R93.2 U41.4(EN) U134.4(Y) U138.2(S)
$1N51953: Q34.3(D) Q35.3(D)
$1N52055: Q36.3(D) Q37.3(D)
$1N52153: Q38.3(D) Q39.3(D)
$1N52251: Q40.3(D) Q41.3(D)
$1N52375: D13.1 FPC6.7 U136.8(HSD2-)
$1N58481: Q42.1(G) R102.2 R104.1
$1N58482: Q43.3(C) R102.1
$1N58542: F1.2 Q12.2(E) Q34.2(S) Q42.3(D) R38.2
$1N58552: C31.2 Q42.2(S) R26.1 R104.2 U30.1(K) U32.5(VIN)
$1N58744: Q45.1(G) R105.2 R106.1
$1N58746: Q44.3(C) R105.1
$1N58779: F2.2 Q13.2(E) Q36.2(S) Q45.3(D) R41.2
$1N58791: C33.2 Q45.2(S) R27.1 R106.2 U31.1(K) U33.5(VIN)
$1N59098: Q47.1(G) R107.2 R108.1
$1N59100: Q46.3(C) R107.1
$1N59133: F3.2 Q24.2(E) Q38.2(S) Q47.3(D) R62.2
$1N59145: C35.2 Q47.2(S) R50.1 R108.2 U38.1(K) U40.5(VIN)
$1N59472: Q49.1(G) R109.2 R110.1
$1N59474: Q48.3(C) R109.1
$1N59489: F4.2 Q25.2(E) Q40.2(S) Q49.3(D) R65.2
$1N59501: C37.2 Q49.2(S) R51.1 R110.2 U39.1(K) U41.5(VIN)
$3N889: RN12.1 SW10.2 U47.6(D7)
$3N898: RN12.2 SW11.2 U47.5(D6)
$3N922: RN12.4 SW13.2 U47.3(D4)
$3N937: RN2.4 SW17.2 U47.11(D0)
$3N954: RN2.1 SW14.2 U47.14(D3)
$3N973: RN2.2 SW15.2 U47.13(D2)
$3N994: RN2.3 SW16.2 U47.12(D1)
$3N3390: RN13.5 SW18.2 U48.6(D7)
$3N3391: RN13.6 SW19.2 U48.5(D6)
$3N3392: RN13.7 SW20.2 U48.4(D5)
$3N3393: RN13.8 SW21.2 U48.3(D4)
$3N3394: RN3.8 SW25.2 U48.11(D0)
$3N3395: RN3.5 SW22.2 U48.14(D3)
$3N3396: RN3.6 SW23.2 U48.13(D2)
$3N3397: RN3.7 SW24.2 U48.12(D1)
$3N5319: RN14.5 SW26.2 U49.6(D7)
$3N5320: RN14.6 SW27.2 U49.5(D6)
$3N5321: RN14.7 SW28.2 U49.4(D5)
$3N5322: RN14.8 SW29.2 U49.3(D4)
$3N5323: RN4.8 SW33.2 U49.11(D0)
$3N5324: RN4.5 SW30.2 U49.14(D3)
$3N5325: RN4.6 SW31.2 U49.13(D2)
$3N5326: RN4.7 SW32.2 U49.12(D1)
$3N5331: RN15.5 SW34.2 U50.6(D7)
$3N5332: RN15.6 SW35.2 U50.5(D6)
$3N5333: RN15.7 SW36.2 U50.4(D5)
$3N5334: RN15.8 SW37.2 U50.3(D4)
$3N5335: RN5.8 SW41.2 U50.11(D0)
$3N5336: RN5.5 SW38.2 U50.14(D3)
$3N5337: RN5.6 SW39.2 U50.13(D2)
$3N5338: RN5.7 SW40.2 U50.12(D1)
$3N9176: RN16.5 SW42.2 U51.6(D7)
$3N9177: RN16.6 SW43.2 U51.5(D6)
$3N9178: RN16.7 SW44.2 U51.4(D5)
$3N9179: RN16.8 SW45.2 U51.3(D4)
$3N9180: RN6.8 SW49.2 U51.11(D0)
$3N9181: RN6.5 SW46.2 U51.14(D3)
$3N9182: RN6.6 SW47.2 U51.13(D2)
$3N9183: RN6.7 SW48.2 U51.12(D1)
$3N9188: RN17.5 SW50.2 U52.6(D7)
$3N9189: RN17.6 SW51.2 U52.5(D6)
$3N9190: RN17.7 SW52.2 U52.4(D5)
$3N9191: RN17.8 SW53.2 U52.3(D4)
$3N9192: RN7.8 SW57.2 U52.11(D0)
$3N9193: RN7.5 SW54.2 U52.14(D3)
$3N9194: RN7.6 SW55.2 U52.13(D2)
$3N9195: RN7.7 SW56.2 U52.12(D1)
$3N9200: RN18.5 SW58.2 U53.6(D7)
$3N9201: RN18.6 SW59.2 U53.5(D6)
$3N9202: RN18.7 SW60.2 U53.4(D5)
$3N9203: RN18.8 SW61.2 U53.3(D4)
$3N9204: RN8.8 SW65.2 U53.11(D0)
$3N9205: RN8.5 SW62.2 U53.14(D3)
$3N9206: RN8.6 SW63.2 U53.13(D2)
$3N9207: RN8.7 SW64.2 U53.12(D1)
$3N9212: RN19.5 SW66.2 U54.6(D7)
$3N9213: RN19.6 SW67.2 U54.5(D6)
$3N9214: RN19.7 SW68.2 U54.4(D5)
$3N9215: RN19.8 SW69.2 U54.3(D4)
$3N9217: RN9.5 SW70.2 U54.14(D3)
$3N9219: RN9.7 SW72.2 U54.12(D1)
$3N13327: RN20.5 SW74.2 U55.6(D7)
$3N13328: RN20.6 SW75.2 U55.5(D6)
$3N29639: U47.10(DS) U48.9(Q7)
$3N43768: U48.10(DS) U49.9(Q7)
$3N44518: U49.10(DS) U50.9(Q7)
$3N44773: U50.10(DS) U51.9(Q7)
$3N45271: U51.10(DS) U52.9(Q7)
$3N45272: U52.10(DS) U53.9(Q7)
$3N45525: U53.10(DS) U54.9(Q7)
$3N45526: U54.10(DS) U55.9(Q7)
$3N61491: RN11.1 SW2.2 U46.6(D7)
$3N61492: RN11.2 SW3.2 U46.5(D6)
$3N61493: RN11.3 SW4.2 U46.4(D5)
$3N61494: RN11.4 SW5.2 U46.3(D4)
$3N61495: RN1.8 SW9.2 U46.11(D0)
$3N61496: RN1.5 SW6.2 U46.14(D3)
$3N61497: RN1.6 SW7.2 U46.13(D2)
$3N61498: RN1.7 SW8.2 U46.12(D1)
$3N62697: U46.10(DS) U47.9(Q7)
$3N211131: FPC9.1 U55.10(DS)
$3N316141: R82.2 R119.2 U55.11(D0)
$3N316223: D30.2(A) RN9.6 U54.13(D2)
$3N316232: RN9.8 SW73.2 U54.11(D0)
$3N328858: R7.2 X1.2
$3N328859: R8.1 X1.5
$4N4242: U56.2(DOUT) U57.4(DIN)
$4N4318: U57.2(DOUT) U58.4(DIN)
$4N4834: U58.2(DOUT) U59.4(DIN)
$4N4836: U59.2(DOUT) U60.4(DIN)
$4N5123: U60.2(DOUT) U61.4(DIN)
$4N5125: U61.2(DOUT) U62.4(DIN)
$4N5412: U62.2(DOUT) U63.4(DIN)
$4N5414: U63.2(DOUT) U64.4(DIN)
$4N6427: U64.2(DOUT) U65.4(DIN)
$4N6429: U65.2(DOUT) U66.4(DIN)
$4N6433: U66.2(DOUT) U67.4(DIN)
$4N6435: U67.2(DOUT) U68.4(DIN)
$4N6439: U68.2(DOUT) U69.4(DIN)
$4N6441: U69.2(DOUT) U70.4(DIN)
$4N6445: U70.2(DOUT) U71.4(DIN)
$4N6447: U71.2(DOUT) U72.4(DIN)
$4N7580: U72.2(DOUT) U73.4(DIN)
$4N7582: U73.2(DOUT) U74.4(DIN)
$4N7586: U74.2(DOUT) U75.4(DIN)
$4N7588: U75.2(DOUT) U76.4(DIN)
$4N7592: U76.2(DOUT) U77.4(DIN)
$4N7594: U77.2(DOUT) U78.4(DIN)
$4N7598: U78.2(DOUT) U79.4(DIN)
$4N7600: U79.2(DOUT) U80.4(DIN)
$4N8733: U80.2(DOUT) U81.4(DIN)
$4N8735: U81.2(DOUT) U82.4(DIN)
$4N8739: U82.2(DOUT) U83.4(DIN)
$4N8741: U83.2(DOUT) U84.4(DIN)
$4N8745: U84.2(DOUT) U85.4(DIN)
$4N8747: U85.2(DOUT) U86.4(DIN)
$4N8751: U86.2(DOUT) U87.4(DIN)
$4N8753: U87.2(DOUT) U88.4(DIN)
$4N9886: U88.2(DOUT) U89.4(DIN)
$4N9888: U89.2(DOUT) U90.4(DIN)
$4N9892: U90.2(DOUT) U91.4(DIN)
$4N9894: U91.2(DOUT) U92.4(DIN)
$4N9898: U92.2(DOUT) U93.4(DIN)
$4N9900: U93.2(DOUT) U94.4(DIN)
$4N9904: U94.2(DOUT) U95.4(DIN)
$4N11370: U95.2(DOUT) U96.4(DIN)
$4N16490: U97.2(DOUT) U98.4(DIN)
$4N16493: U98.2(DOUT) U99.4(DIN)
$4N16497: U99.2(DOUT) U100.4(DIN)
$4N16499: U100.2(DOUT) U101.4(DIN)
$4N16503: U101.2(DOUT) U102.4(DIN)
$4N16505: U102.2(DOUT) U103.4(DIN)
$4N16509: U103.2(DOUT) U104.4(DIN)
$4N16511: U104.2(DOUT) U105.4(DIN)
$4N16515: U105.2(DOUT) U106.4(DIN)
$4N16517: U106.2(DOUT) U107.4(DIN)
$4N16521: U107.2(DOUT) U108.4(DIN)
$4N16523: U108.2(DOUT) U109.4(DIN)
$4N16527: U109.2(DOUT) U110.4(DIN)
$4N16529: U110.2(DOUT) U111.4(DIN)
$4N16533: U111.2(DOUT) U112.4(DIN)
$4N16535: U112.2(DOUT) U113.4(DIN)
$4N16539: U113.2(DOUT) U114.4(DIN)
$4N16541: U114.2(DOUT) U115.4(DIN)
$4N16545: U115.2(DOUT) U116.4(DIN)
$4N16547: U116.2(DOUT) U117.4(DIN)
$4N16551: U117.2(DOUT) U118.4(DIN)
$4N16553: U118.2(DOUT) U119.4(DIN)
$4N16557: U119.2(DOUT) U120.4(DIN)
$4N16559: U120.2(DOUT) U121.4(DIN)
$4N16563: U121.2(DOUT) U122.4(DIN)
$4N16565: U122.2(DOUT) U123.4(DIN)
$4N16569: U123.2(DOUT) U124.4(DIN)
$4N16571: U124.2(DOUT) U125.4(DIN)
$4N16575: U125.2(DOUT) U126.4(DIN)
$4N16577: U126.2(DOUT) U127.4(DIN)
$4N16581: U127.2(DOUT) U128.4(DIN)
$4N16583: U128.2(DOUT) U129.4(DIN)
$4N37165: U96.2(DOUT) U97.4(DIN)
$4N50144: D42.2(A) L7.1 U142.1(LX)
$4N50145: C23.1 CN1.1 D42.1(K) U142.5(OVP)
$4N50148: CN1.2 R120.2 U142.3(FB)

Not connected (* = marked no-connect by the designer): RN10 8*; U1 28(IO35)* 29(IO36)* 30(IO37)*; U32 6(NC)*; U33 6(NC)*; U40 6(NC)*; U41 6(NC)*; U46 7(Q7#); U47 7(Q7#); U48 7(Q7#); U49 7(Q7#); U50 7(Q7#); U51 7(Q7#); U52 7(Q7#); U53 7(Q7#); U54 7(Q7#); U55 7(Q7#); U135 6(HSD1-)* 7(HSD1+)*; U136 6(HSD1-)* 7(HSD1+)*; U137 6(HSD1-)* 7(HSD1+)*; U138 6(HSD1-)* 7(HSD1+)*

## Notes on the sheets
sheet 1
- IIC扩展接口
sheet 4
- (WPD)
